# EAGLE design p25rx_display_rev3 (EAGLE 7.6.0)

## Sheet 1 of 7
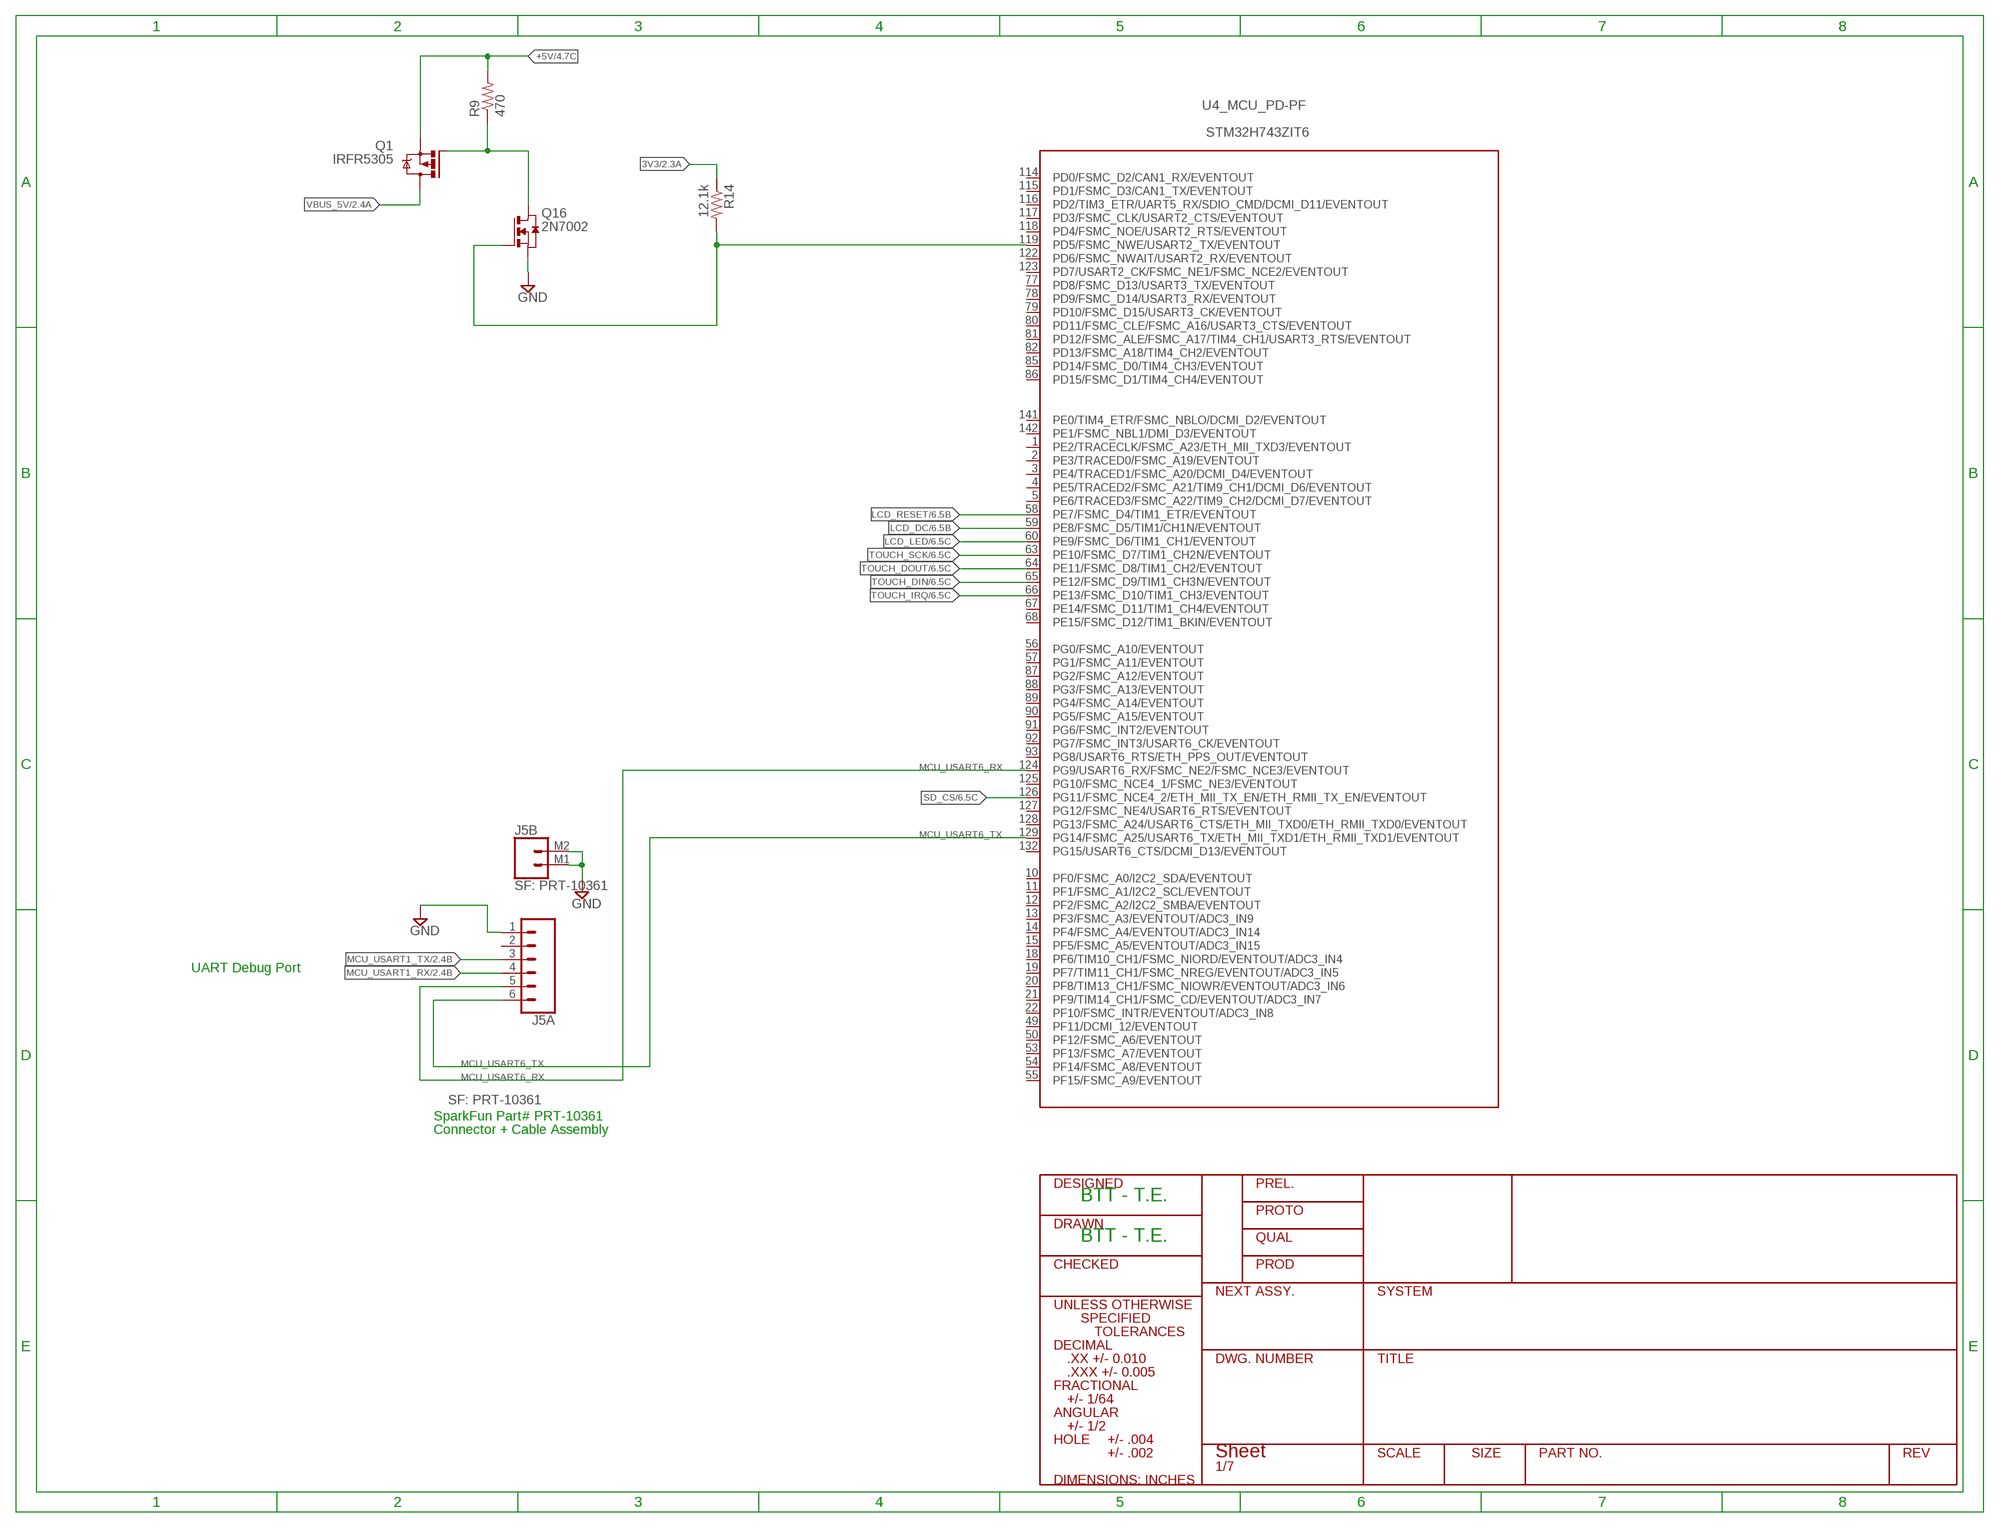
[diagram p0: schematic, sheet 1]

### Parts
J5  SF: PRT-10361  JST_6_PIN_HORIZONTAL  [JST-6-SMD-HORI-1.0MM]
Q1  IRFR5305  [D-PAK_TO252AA]
Q16  2N7002  [SOT23_2N7002_PACKAGE]
R9  470  R-US_R0603  [R0603]
R14  12.1k  R-US_R0402  [R0402]
U4  STM32H743ZIT6  STM32F407_144_MG144  [STM32F407_144]

### Nets
3V3: R14.1 ; also sheet 2,3,4,5,6
+5V: Q1.3(S) R9.2 ; also sheet 4,5
GND: J5.1 J5.M1 J5.M2 Q16.2(S) ; also sheet 2,3,4,5,6
LCD_DC: U4.59(_MCU_PD-PF:PE8/FSMC_D5/TIM1/CH1N/EVENTOUT) ; also sheet 6
LCD_LED: U4.60(_MCU_PD-PF:PE9/FSMC_D6/TIM1_CH1/EVENTOUT) ; also sheet 6
LCD_RESET: U4.58(_MCU_PD-PF:PE7/FSMC_D4/TIM1_ETR/EVENTOUT) ; also sheet 6
MCU_USART1_RX: J5.4 ; also sheet 2
MCU_USART1_TX: J5.3 ; also sheet 2
MCU_USART6_RX: J5.5 U4.124(_MCU_PD-PF:PG9/USART6_RX/FSMC_NE2/FSMC_NCE3/EVENTOUT)
MCU_USART6_TX: J5.6 U4.129(_MCU_PD-PF:PG14/FSMC_A25/USART6_TX/ETH_MII_TXD1/ETH_RMII_TXD1/EVENTOUT)
N$3: Q16.1(G) R14.2 U4.119(_MCU_PD-PF:PD5/FSMC_NWE/USART2_TX/EVENTOUT)
N$137: Q1.1(G) Q16.3(D) R9.1
SD_CS: U4.126(_MCU_PD-PF:PG11/FSMC_NCE4_2/ETH_MII_TX_EN/ETH_RMII_TX_EN/EVENTOUT) ; also sheet 6
TOUCH_DIN: U4.65(_MCU_PD-PF:PE12/FSMC_D9/TIM1_CH3N/EVENTOUT) ; also sheet 6
TOUCH_DOUT: U4.64(_MCU_PD-PF:PE11/FSMC_D8/TIM1_CH2/EVENTOUT) ; also sheet 6
TOUCH_IRQ: U4.66(_MCU_PD-PF:PE13/FSMC_D10/TIM1_CH3/EVENTOUT) ; also sheet 6
TOUCH_SCK: U4.63(_MCU_PD-PF:PE10/FSMC_D7/TIM1_CH2N/EVENTOUT) ; also sheet 6
VBUS_5V: Q1.4(D) ; also sheet 2,5
Unconnected: J5.2 U4.1(_MCU_PD-PF:PE2/TRACECLK/FSMC_A23/ETH_MII_TXD3/EVENTOUT) U4.2(_MCU_PD-PF:PE3/TRACED0/FSMC_A19/EVENTOUT) U4.3(_MCU_PD-PF:PE4/TRACED1/FSMC_A20/DCMI_D4/EVENTOUT) U4.4(_MCU_PD-PF:PE5/TRACED2/FSMC_A21/TIM9_CH1/DCMI_D6/EVENTOUT) U4.5(_MCU_PD-PF:PE6/TRACED3/FSMC_A22/TIM9_CH2/DCMI_D7/EVENTOUT) U4.10(_MCU_PD-PF:PF0/FSMC_A0/I2C2_SDA/EVENTOUT) U4.11(_MCU_PD-PF:PF1/FSMC_A1/I2C2_SCL/EVENTOUT) U4.12(_MCU_PD-PF:PF2/FSMC_A2/I2C2_SMBA/EVENTOUT) U4.13(_MCU_PD-PF:PF3/FSMC_A3/EVENTOUT/ADC3_IN9) U4.14(_MCU_PD-PF:PF4/FSMC_A4/EVENTOUT/ADC3_IN14) U4.15(_MCU_PD-PF:PF5/FSMC_A5/EVENTOUT/ADC3_IN15) U4.18(_MCU_PD-PF:PF6/TIM10_CH1/FSMC_NIORD/EVENTOUT/ADC3_IN4) U4.19(_MCU_PD-PF:PF7/TIM11_CH1/FSMC_NREG/EVENTOUT/ADC3_IN5) U4.20(_MCU_PD-PF:PF8/TIM13_CH1/FSMC_NIOWR/EVENTOUT/ADC3_IN6) U4.21(_MCU_PD-PF:PF9/TIM14_CH1/FSMC_CD/EVENTOUT/ADC3_IN7) U4.22(_MCU_PD-PF:PF10/FSMC_INTR/EVENTOUT/ADC3_IN8) U4.49(_MCU_PD-PF:PF11/DCMI_12/EVENTOUT) U4.50(_MCU_PD-PF:PF12/FSMC_A6/EVENTOUT) U4.53(_MCU_PD-PF:PF13/FSMC_A7/EVENTOUT) U4.54(_MCU_PD-PF:PF14/FSMC_A8/EVENTOUT) U4.55(_MCU_PD-PF:PF15/FSMC_A9/EVENTOUT) U4.56(_MCU_PD-PF:PG0/FSMC_A10/EVENTOUT) U4.57(_MCU_PD-PF:PG1/FSMC_A11/EVENTOUT) U4.67(_MCU_PD-PF:PE14/FSMC_D11/TIM1_CH4/EVENTOUT) U4.68(_MCU_PD-PF:PE15/FSMC_D12/TIM1_BKIN/EVENTOUT) U4.77(_MCU_PD-PF:PD8/FSMC_D13/USART3_TX/EVENTOUT) U4.78(_MCU_PD-PF:PD9/FSMC_D14/USART3_RX/EVENTOUT) U4.79(_MCU_PD-PF:PD10/FSMC_D15/USART3_CK/EVENTOUT) U4.80(_MCU_PD-PF:PD11/FSMC_CLE/FSMC_A16/USART3_CTS/EVENTOUT) U4.81(_MCU_PD-PF:PD12/FSMC_ALE/FSMC_A17/TIM4_CH1/USART3_RTS/EVENTOUT) U4.82(_MCU_PD-PF:PD13/FSMC_A18/TIM4_CH2/EVENTOUT) U4.85(_MCU_PD-PF:PD14/FSMC_D0/TIM4_CH3/EVENTOUT) U4.86(_MCU_PD-PF:PD15/FSMC_D1/TIM4_CH4/EVENTOUT) U4.87(_MCU_PD-PF:PG2/FSMC_A12/EVENTOUT) U4.88(_MCU_PD-PF:PG3/FSMC_A13/EVENTOUT) U4.89(_MCU_PD-PF:PG4/FSMC_A14/EVENTOUT) U4.90(_MCU_PD-PF:PG5/FSMC_A15/EVENTOUT) U4.91(_MCU_PD-PF:PG6/FSMC_INT2/EVENTOUT) U4.92(_MCU_PD-PF:PG7/FSMC_INT3/USART6_CK/EVENTOUT) U4.93(_MCU_PD-PF:PG8/USART6_RTS/ETH_PPS_OUT/EVENTOUT) U4.114(_MCU_PD-PF:PD0/FSMC_D2/CAN1_RX/EVENTOUT) U4.115(_MCU_PD-PF:PD1/FSMC_D3/CAN1_TX/EVENTOUT) U4.116(_MCU_PD-PF:PD2/TIM3_ETR/UART5_RX/SDIO_CMD/DCMI_D11/EVENTOUT) U4.117(_MCU_PD-PF:PD3/FSMC_CLK/USART2_CTS/EVENTOUT) U4.118(_MCU_PD-PF:PD4/FSMC_NOE/USART2_RTS/EVENTOUT) U4.122(_MCU_PD-PF:PD6/FSMC_NWAIT/USART2_RX/EVENTOUT) U4.123(_MCU_PD-PF:PD7/USART2_CK/FSMC_NE1/FSMC_NCE2/EVENTOUT) U4.125(_MCU_PD-PF:PG10/FSMC_NCE4_1/FSMC_NE3/EVENTOUT) U4.127(_MCU_PD-PF:PG12/FSMC_NE4/USART6_RTS/EVENTOUT) U4.128(_MCU_PD-PF:PG13/FSMC_A24/USART6_CTS/ETH_MII_TXD0/ETH_RMII_TXD0/EVENTOUT) U4.132(_MCU_PD-PF:PG15/USART6_CTS/DCMI_D13/EVENTOUT) U4.141(_MCU_PD-PF:PE0/TIM4_ETR/FSMC_NBLO/DCMI_D2/EVENTOUT) U4.142(_MCU_PD-PF:PE1/FSMC_NBL1/DMI_D3/EVENTOUT)

### Notes on the sheet
- UART Debug Port
- SparkFun Part# PRT-10361
- Connector + Cable Assembly
- BTT - T.E.
- BTT - T.E.

## Sheet 2 of 7
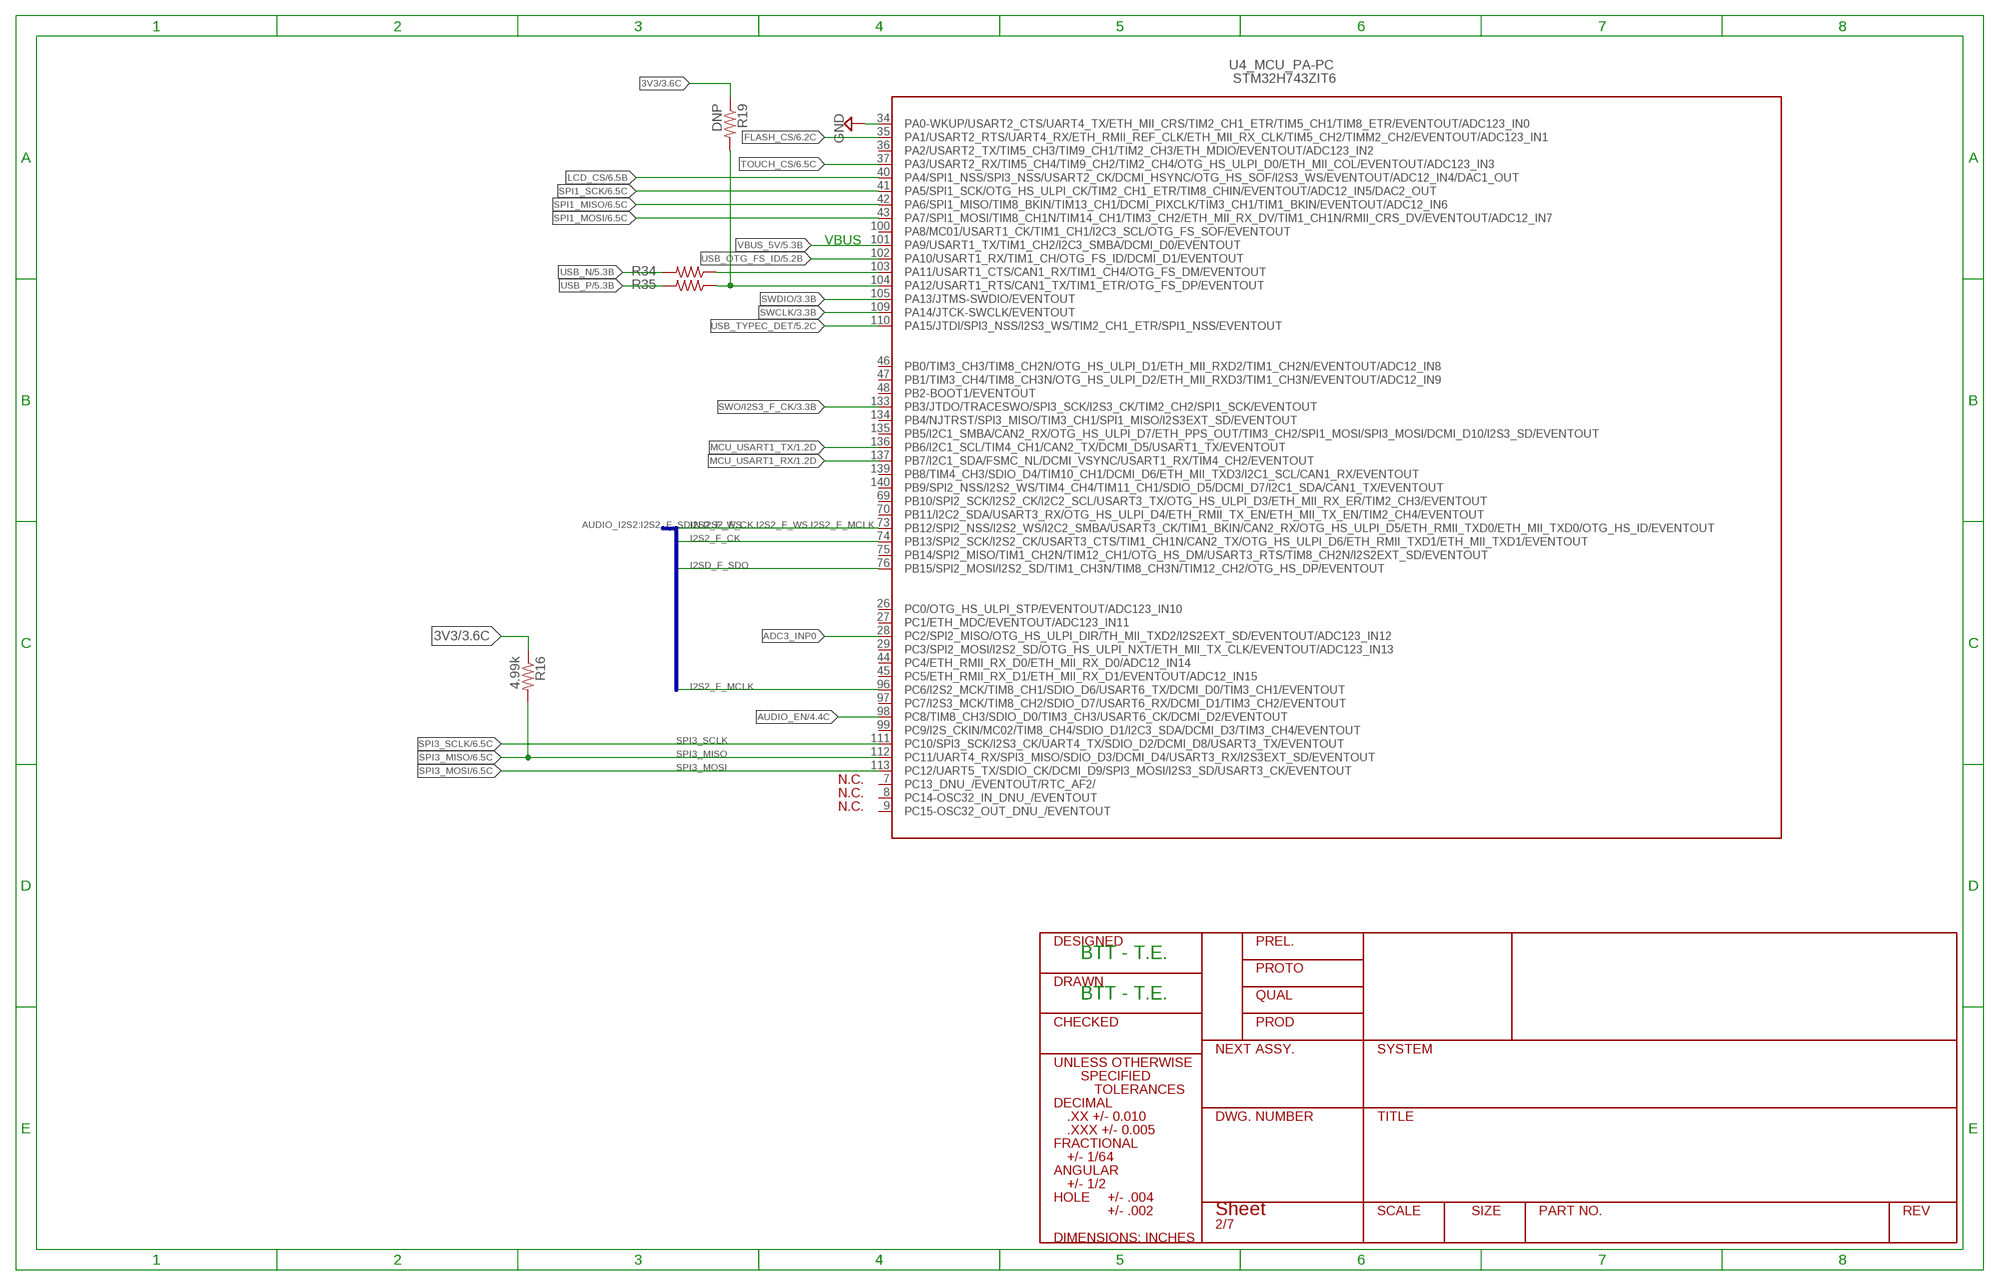
[diagram p1: schematic, sheet 2]

### Parts
R16  4.99k  R-US_R0402  [R0402]
R19  DNP  R-US_R0603  [R0603]
R34  470  R-US_R0402  [R0402]
R35  470  R-US_R0402  [R0402]

### Nets
3V3: R16.1 R19.1 ; also sheet 1,3,4,5,6
ADC3_INP0: U4.28(_MCU_PA-PC:PC2/SPI2_MISO/OTG_HS_ULPI_DIR/TH_MII_TXD2/I2S2EXT_SD/EVENTOUT/ADC123_IN12)
AUDIO_EN: U4.98(_MCU_PA-PC:PC8/TIM8_CH3/SDIO_D0/TIM3_CH3/USART6_CK/DCMI_D2/EVENTOUT) ; also sheet 4
FLASH_CS: U4.35(_MCU_PA-PC:PA1/USART2_RTS/UART4_RX/ETH_RMII_REF_CLK/ETH_MII_RX_CLK/TIM5_CH2/TIMM2_CH2/EVENTOUT/ADC123_IN1) ; also sheet 6
GND: U4.34(_MCU_PA-PC:PA0-WKUP/USART2_CTS/UART4_TX/ETH_MII_CRS/TIM2_CH1_ETR/TIM5_CH1/TIM8_ETR/EVENTOUT/ADC123_IN0) ; also sheet 1,3,4,5,6
I2S2_F_CK: U4.74(_MCU_PA-PC:PB13/SPI2_SCK/I2S2_CK/USART3_CTS/TIM1_CH1N/CAN2_TX/OTG_HS_ULPI_D6/ETH_RMII_TXD1/ETH_MII_TXD1/EVENTOUT) ; also sheet 4
I2S2_F_MCLK: U4.96(_MCU_PA-PC:PC6/I2S2_MCK/TIM8_CH1/SDIO_D6/USART6_TX/DCMI_D0/TIM3_CH1/EVENTOUT) ; also sheet 4
I2S2_F_WS: U4.73(_MCU_PA-PC:PB12/SPI2_NSS/I2S2_WS/I2C2_SMBA/USART3_CK/TIM1_BKIN/CAN2_RX/OTG_HS_ULPI_D5/ETH_RMII_TXD0/ETH_MII_TXD0/OTG_HS_ID/EVENTOUT) ; also sheet 4
I2SD_F_SDO: U4.76(_MCU_PA-PC:PB15/SPI2_MOSI/I2S2_SD/TIM1_CH3N/TIM8_CH3N/TIM12_CH2/OTG_HS_DP/EVENTOUT) ; also sheet 4
LCD_CS: U4.40(_MCU_PA-PC:PA4/SPI1_NSS/SPI3_NSS/USART2_CK/DCMI_HSYNC/OTG_HS_SOF/I2S3_WS/EVENTOUT/ADC12_IN4/DAC1_OUT) ; also sheet 6
MCU_USART1_RX: U4.137(_MCU_PA-PC:PB7/I2C1_SDA/FSMC_NL/DCMI_VSYNC/USART1_RX/TIM4_CH2/EVENTOUT) ; also sheet 1
MCU_USART1_TX: U4.136(_MCU_PA-PC:PB6/I2C1_SCL/TIM4_CH1/CAN2_TX/DCMI_D5/USART1_TX/EVENTOUT) ; also sheet 1
SPI1_MISO: U4.42(_MCU_PA-PC:PA6/SPI1_MISO/TIM8_BKIN/TIM13_CH1/DCMI_PIXCLK/TIM3_CH1/TIM1_BKIN/EVENTOUT/ADC12_IN6) ; also sheet 6
SPI1_MOSI: U4.43(_MCU_PA-PC:PA7/SPI1_MOSI/TIM8_CH1N/TIM14_CH1/TIM3_CH2/ETH_MII_RX_DV/TIM1_CH1N/RMII_CRS_DV/EVENTOUT/ADC12_IN7) ; also sheet 6
SPI1_SCK: U4.41(_MCU_PA-PC:PA5/SPI1_SCK/OTG_HS_ULPI_CK/TIM2_CH1_ETR/TIM8_CHIN/EVENTOUT/ADC12_IN5/DAC2_OUT) ; also sheet 6
SPI3_MISO: R16.2 U4.112(_MCU_PA-PC:PC11/UART4_RX/SPI3_MISO/SDIO_D3/DCMI_D4/USART3_RX/I2S3EXT_SD/EVENTOUT) ; also sheet 6
SPI3_MOSI: U4.113(_MCU_PA-PC:PC12/UART5_TX/SDIO_CK/DCMI_D9/SPI3_MOSI/I2S3_SD/USART3_CK/EVENTOUT) ; also sheet 6
SPI3_SCLK: U4.111(_MCU_PA-PC:PC10/SPI3_SCK/I2S3_CK/UART4_TX/SDIO_D2/DCMI_D8/USART3_TX/EVENTOUT) ; also sheet 6
SWCLK: U4.109(_MCU_PA-PC:PA14/JTCK-SWCLK/EVENTOUT) ; also sheet 3
SWDIO: U4.105(_MCU_PA-PC:PA13/JTMS-SWDIO/EVENTOUT) ; also sheet 3
SWO/I2S3_F_CK: U4.133(_MCU_PA-PC:PB3/JTDO/TRACESWO/SPI3_SCK/I2S3_CK/TIM2_CH2/SPI1_SCK/EVENTOUT) ; also sheet 3
TOUCH_CS: U4.37(_MCU_PA-PC:PA3/USART2_RX/TIM5_CH4/TIM9_CH2/TIM2_CH4/OTG_HS_ULPI_D0/ETH_MII_COL/EVENTOUT/ADC123_IN3) ; also sheet 6
USB_MCU_N: R34.1 U4.103(_MCU_PA-PC:PA11/USART1_CTS/CAN1_RX/TIM1_CH4/OTG_FS_DM/EVENTOUT)
USB_MCU_P: R19.2 R35.1 U4.104(_MCU_PA-PC:PA12/USART1_RTS/CAN1_TX/TIM1_ETR/OTG_FS_DP/EVENTOUT)
USB_N [differential]: R34.2 ; also sheet 5
USB_OTG_FS_ID: U4.102(_MCU_PA-PC:PA10/USART1_RX/TIM1_CH/OTG_FS_ID/DCMI_D1/EVENTOUT) ; also sheet 5
USB_P [differential]: R35.2 ; also sheet 5
USB_TYPEC_DET: U4.110(_MCU_PA-PC:PA15/JTDI/SPI3_NSS/I2S3_WS/TIM2_CH1_ETR/SPI1_NSS/EVENTOUT) ; also sheet 5
VBUS_5V: U4.101(_MCU_PA-PC:PA9/USART1_TX/TIM1_CH2/I2C3_SMBA/DCMI_D0/EVENTOUT) ; also sheet 1,5
Unconnected: U4.7(_MCU_PA-PC:PC13_DNU_/EVENTOUT/RTC_AF2/) U4.8(_MCU_PA-PC:PC14-OSC32_IN_DNU_/EVENTOUT) U4.9(_MCU_PA-PC:PC15-OSC32_OUT_DNU_/EVENTOUT) U4.26(_MCU_PA-PC:PC0/OTG_HS_ULPI_STP/EVENTOUT/ADC123_IN10) U4.27(_MCU_PA-PC:PC1/ETH_MDC/EVENTOUT/ADC123_IN11) U4.29(_MCU_PA-PC:PC3/SPI2_MOSI/I2S2_SD/OTG_HS_ULPI_NXT/ETH_MII_TX_CLK/EVENTOUT/ADC123_IN13) U4.36(_MCU_PA-PC:PA2/USART2_TX/TIM5_CH3/TIM9_CH1/TIM2_CH3/ETH_MDIO/EVENTOUT/ADC123_IN2) U4.44(_MCU_PA-PC:PC4/ETH_RMII_RX_D0/ETH_MII_RX_D0/ADC12_IN14) U4.45(_MCU_PA-PC:PC5/ETH_RMII_RX_D1/ETH_MII_RX_D1/EVENTOUT/ADC12_IN15) U4.46(_MCU_PA-PC:PB0/TIM3_CH3/TIM8_CH2N/OTG_HS_ULPI_D1/ETH_MII_RXD2/TIM1_CH2N/EVENTOUT/ADC12_IN8) U4.47(_MCU_PA-PC:PB1/TIM3_CH4/TIM8_CH3N/OTG_HS_ULPI_D2/ETH_MII_RXD3/TIM1_CH3N/EVENTOUT/ADC12_IN9) U4.48(_MCU_PA-PC:PB2-BOOT1/EVENTOUT) U4.69(_MCU_PA-PC:PB10/SPI2_SCK/I2S2_CK/I2C2_SCL/USART3_TX/OTG_HS_ULPI_D3/ETH_MII_RX_ER/TIM2_CH3/EVENTOUT) U4.70(_MCU_PA-PC:PB11/I2C2_SDA/USART3_RX/OTG_HS_ULPI_D4/ETH_RMII_TX_EN/ETH_MII_TX_EN/TIM2_CH4/EVENTOUT) U4.75(_MCU_PA-PC:PB14/SPI2_MISO/TIM1_CH2N/TIM12_CH1/OTG_HS_DM/USART3_RTS/TIM8_CH2N/I2S2EXT_SD/EVENTOUT) U4.97(_MCU_PA-PC:PC7/I2S3_MCK/TIM8_CH2/SDIO_D7/USART6_RX/DCMI_D1/TIM3_CH2/EVENTOUT) U4.99(_MCU_PA-PC:PC9/I2S_CKIN/MC02/TIM8_CH4/SDIO_D1/I2C3_SDA/DCMI_D3/TIM3_CH4/EVENTOUT) U4.100(_MCU_PA-PC:PA8/MC01/USART1_CK/TIM1_CH1/I2C3_SCL/OTG_FS_SOF/EVENTOUT) U4.134(_MCU_PA-PC:PB4/NJTRST/SPI3_MISO/TIM3_CH1/SPI1_MISO/I2S3EXT_SD/EVENTOUT) U4.135(_MCU_PA-PC:PB5/I2C1_SMBA/CAN2_RX/OTG_HS_ULPI_D7/ETH_PPS_OUT/TIM3_CH2/SPI1_MOSI/SPI3_MOSI/DCMI_D10/I2S3_SD/EVENTOUT) U4.139(_MCU_PA-PC:PB8/TIM4_CH3/SDIO_D4/TIM10_CH1/DCMI_D6/ETH_MII_TXD3/I2C1_SCL/CAN1_RX/EVENTOUT) U4.140(_MCU_PA-PC:PB9/SPI2_NSS/I2S2_WS/TIM4_CH4/TIM11_CH1/SDIO_D5/DCMI_D7/I2C1_SDA/CAN1_TX/EVENTOUT)

### Buses
AUDIO_I2S2:I2S2_F_SDIN,I2S2_F_CK,I2S2_F_WS,I2S2_F_MCLK

### Notes on the sheet
- VBUS
- BTT - T.E.
- BTT - T.E.

## Sheet 3 of 7
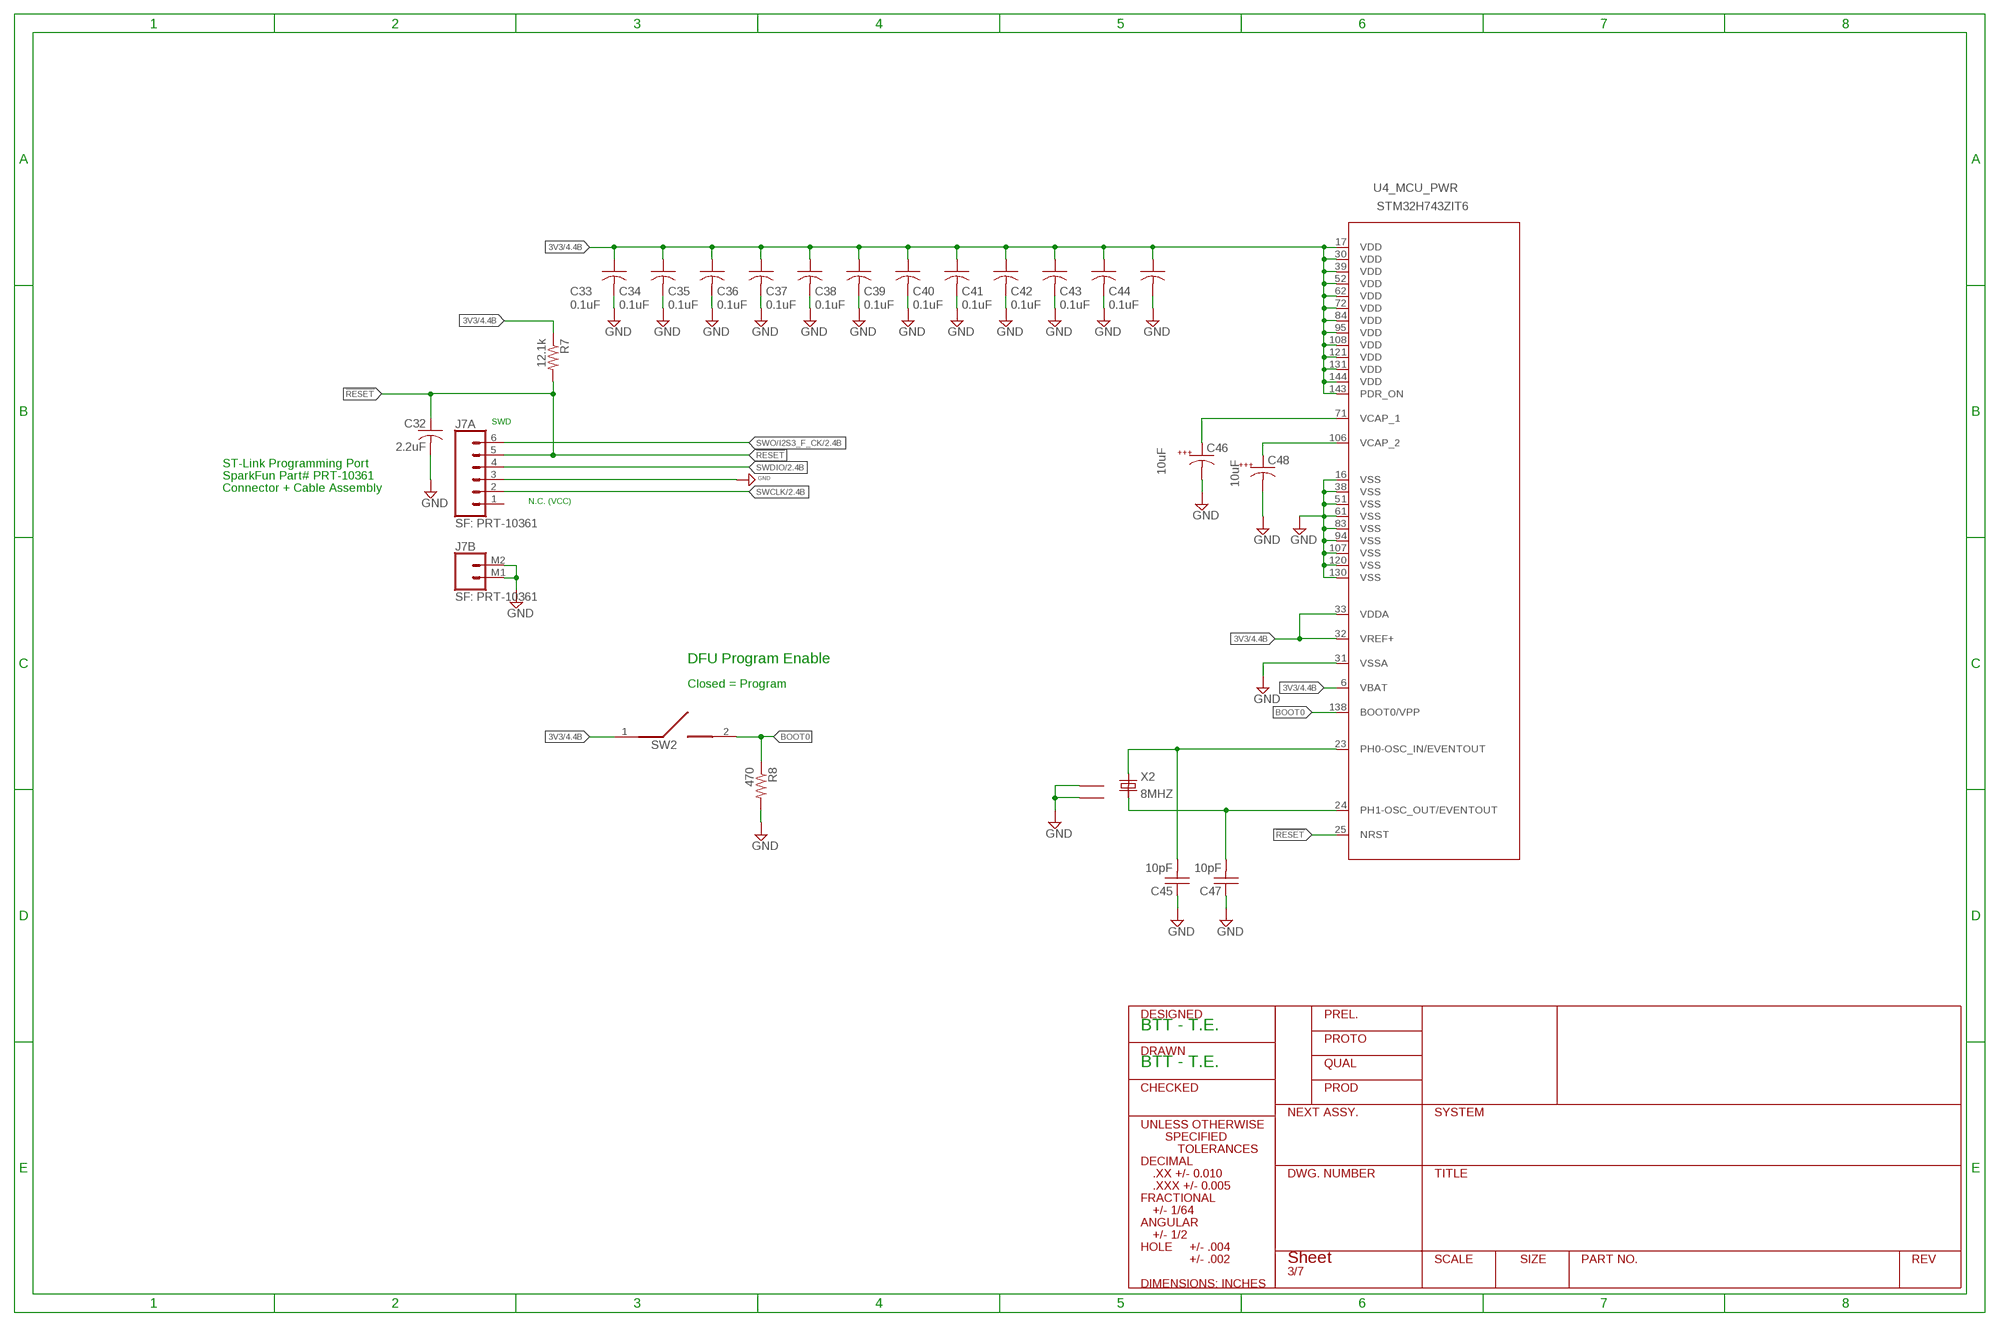
[diagram p2: schematic, sheet 3]

### Parts
C32  2.2uF  C-USC0805  [C0805]
C33  0.1uF  CAPACITOR0402  [0402]
C34  0.1uF  CAPACITOR0402  [0402]
C35  0.1uF  CAPACITOR0402  [0402]
C36  0.1uF  CAPACITOR0402  [0402]
C37  0.1uF  CAPACITOR0402  [0402]
C38  0.1uF  CAPACITOR0402  [0402]
C39  0.1uF  CAPACITOR0402  [0402]
C40  0.1uF  CAPACITOR0402  [0402]
C41  0.1uF  CAPACITOR0402  [0402]
C42  0.1uF  CAPACITOR0402  [0402]
C43  0.1uF  CAPACITOR0402  [0402]
C44  0.1uF  CAPACITOR0402  [0402]
C45  10pF  C-USC0603  [C0603]
C46  10uF  CAPACITOR1210K  [1210K]
C47  10pF  C-USC0603  [C0603]
C48  10uF  CAPACITOR1210K  [1210K]
J7  SF: PRT-10361  JST_6_PIN_HORIZONTAL  [JST-6-SMD-HORI-1.0MM]
R7  12.1k  R-US_R0603  [R0603]
R8  470  R-US_R0402  [R0402]
SW2  CHS-01TA  [CHS1BIT]
X2  8MHZ  ECS-250-20-30B-DUDU  [ECS-250-20-30B-DU_CRYSTAL]

### Nets
3V3: C33.1(A) C34.1(A) C35.1(A) C36.1(A) C37.1(A) C38.1(A) C39.1(A) C40.1(A) C41.1(A) C42.1(A) C43.1(A) C44.1(A) R7.1 SW2.1 U4.6(_MCU_PWR:VBAT) U4.17(_MCU_PWR:VDD) U4.30(_MCU_PWR:VDD) U4.32(_MCU_PWR:VREF+) U4.33(_MCU_PWR:VDDA) U4.39(_MCU_PWR:VDD) U4.52(_MCU_PWR:VDD) U4.62(_MCU_PWR:VDD) U4.72(_MCU_PWR:VDD) U4.84(_MCU_PWR:VDD) U4.95(_MCU_PWR:VDD) U4.108(_MCU_PWR:VDD) U4.121(_MCU_PWR:VDD) U4.131(_MCU_PWR:VDD) U4.143(_MCU_PWR:PDR_ON) U4.144(_MCU_PWR:VDD) ; also sheet 1,2,4,5,6
20MHZ_REF: C45.2 U4.23(_MCU_PWR:PH0-OSC_IN/EVENTOUT) X2.1
!RESET: C32.1 J7.5 R7.2 U4.25(_MCU_PWR:NRST)
BOOT0: R8.1 SW2.2 U4.138(_MCU_PWR:BOOT0/VPP)
GND: C32.2 C33.2(C) C34.2(C) C35.2(C) C36.2(C) C37.2(C) C38.2(C) C39.2(C) C40.2(C) C41.2(C) C42.2(C) C43.2(C) C44.2(C) C45.1 C46.C C47.1 C48.C J7.3 J7.M1 J7.M2 R8.2 U4.16(_MCU_PWR:VSS) U4.31(_MCU_PWR:VSSA) U4.38(_MCU_PWR:VSS) U4.51(_MCU_PWR:VSS) U4.61(_MCU_PWR:VSS) U4.83(_MCU_PWR:VSS) U4.94(_MCU_PWR:VSS) U4.107(_MCU_PWR:VSS) U4.120(_MCU_PWR:VSS) U4.130(_MCU_PWR:VSS) X2.GND@1 X2.GND@2 ; also sheet 1,2,4,5,6
N$30: C48.A U4.106(_MCU_PWR:VCAP_2)
N$35: C46.A U4.71(_MCU_PWR:VCAP_1)
SWCLK: J7.2 ; also sheet 2
SWDIO: J7.4 ; also sheet 2
SWO/I2S3_F_CK: J7.6 ; also sheet 2
X2: C47.2 U4.24(_MCU_PWR:PH1-OSC_OUT/EVENTOUT) X2.3
Unconnected: J7.1

### Notes on the sheet
- SWD
- ST-Link Programming Port
- SparkFun Part# PRT-10361
- Connector + Cable Assembly
- N.C. (VCC)
- DFU Program Enable
- Closed = Program
- BTT - T.E.
- BTT - T.E.

## Sheet 4 of 7
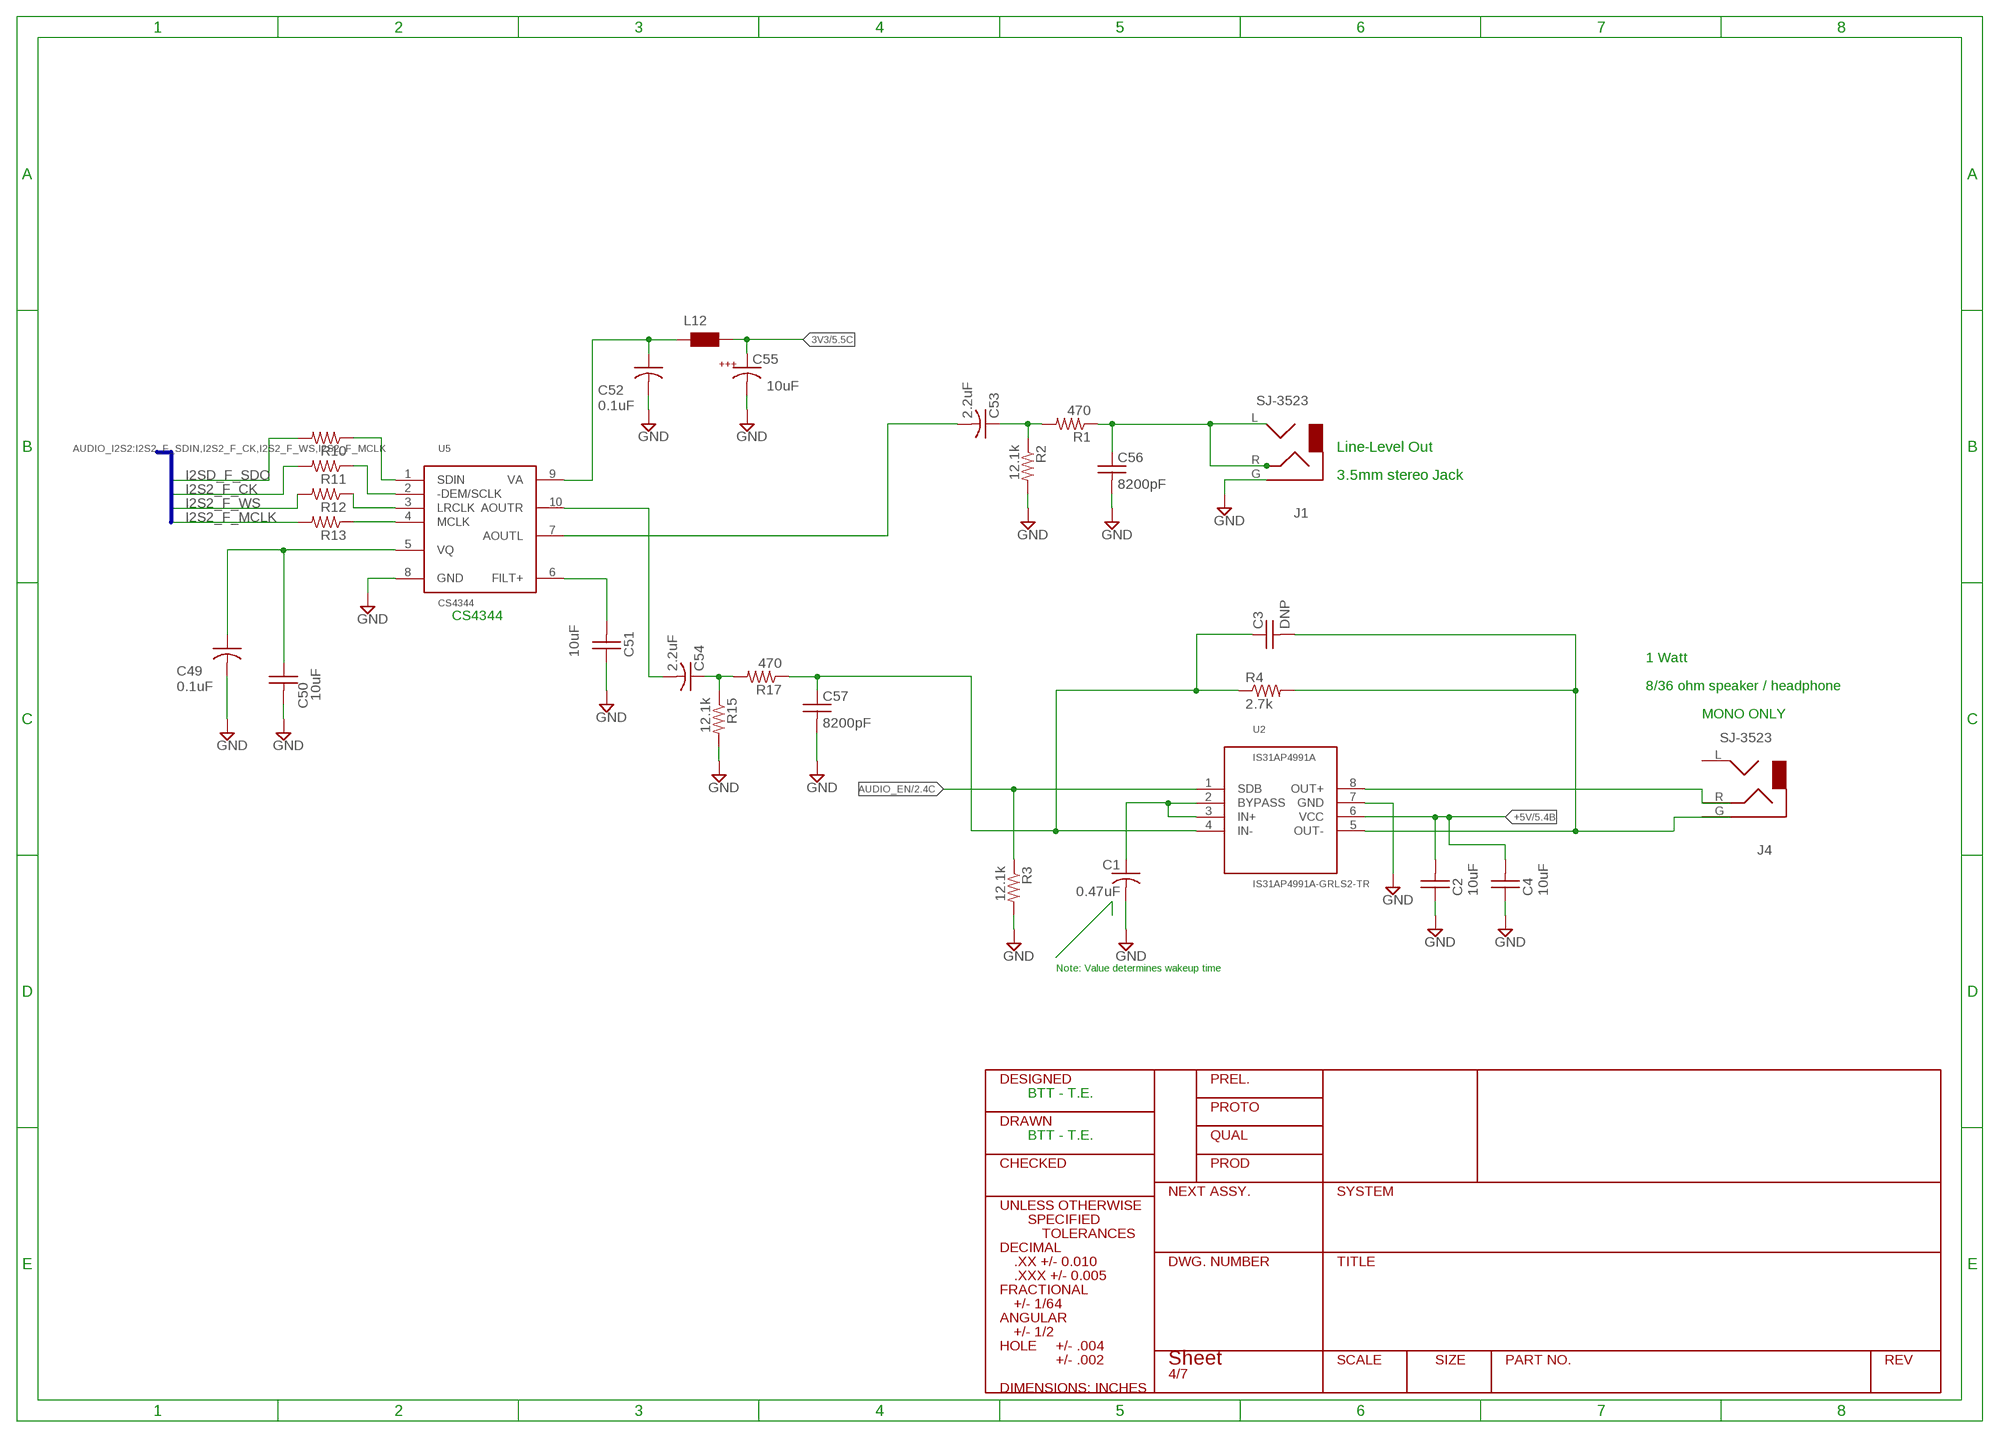
[diagram p3: schematic, sheet 4]

### Parts
C1  0.47uF  C-USC0805  [C0805]
C2  10uF  C-USC0805  [C0805]
C3  DNP  C-USC0603  [C0603]
C4  10uF  C-USC0805  [C0805]
C49  0.1uF  CAPACITOR0402  [0402]
C50  10uF  C-USC0805  [C0805]
C51  10uF  C-USC0805  [C0805]
C52  0.1uF  CAPACITOR0402  [0402]
C53  2.2uF  C-USC0805  [C0805]
C54  2.2uF  C-USC0805  [C0805]
C55  10uF  CAPACITOR1210K  [1210K]
C56  8200pF  C-USC0603  [C0603]
C57  8200pF  C-USC0603  [C0603]
J1  SJ-3523  CUI_SJ-3523SMT  [SJ-3523]
J4  SJ-3523  CUI_SJ-3523SMT  [SJ-3523]
L12  WE-CBF_0603  [0603]
R1  470  R-US_R0402  [R0402]
R2  12.1k  R-US_R0603  [R0603]
R3  12.1k  R-US_R0603  [R0603]
R4  2.7k  R-US_R0603  [R0603]
R10  470  R-US_R0402  [R0402]
R11  470  R-US_R0402  [R0402]
R12  470  R-US_R0402  [R0402]
R13  470  R-US_R0402  [R0402]
R15  12.1k  R-US_R0603  [R0603]
R17  470  R-US_R0402  [R0402]
U2  IS31AP4991A-GRLS2-TR  [SO8]
U5  CS4344  [MSOP10]

### Nets
3V3: C55.A L12.2 ; also sheet 1,2,3,5,6
+5V: C2.2 C4.2 U2.6(VCC) ; also sheet 1,5
AUDIO_EN: R3.1 U2.1(SDB) ; also sheet 2
AUDIO_LEFT: C56.1 J1.L J1.R R1.1
AUDIO_RIGHT: C3.1 C57.1 R4.1 R17.1 U2.4(IN-)
GND: C1.2 C2.1 C4.1 C49.2(C) C50.2 C51.1 C52.2(C) C55.C C56.2 C57.2 J1.G R2.2 R3.2 R15.2 U2.7(GND) U5.8(GND) ; also sheet 1,2,3,5,6
I2S2_F_CK: R11.2 ; also sheet 2
I2S2_F_MCLK: R13.2 ; also sheet 2
I2S2_F_WS: R12.2 ; also sheet 2
I2SD_F_SDO: R10.2 ; also sheet 2
N$2: J4.R U2.8(OUT+)
N$5: C1.1 U2.2(BYPASS) U2.3(IN+)
N$6: C3.2 J4.G R4.2 U2.5(OUT-)
N$16: C53.2 U5.7(AOUTL)
N$26: C54.2 U5.10(AOUTR)
N$27: R13.1 U5.4(MCLK)
N$29: R12.1 U5.3(LRCLK)
N$34: R11.1 U5.2(-DEM/SCLK)
N$43: R10.1 U5.1(SDIN)
N$51: C51.2 U5.6(FILT+)
N$53: C49.1(A) C50.1 U5.5(VQ)
N$56: C53.1 R1.2 R2.1
N$57: C54.1 R15.1 R17.2
N$66: C52.1(A) L12.1 U5.9(VA)
Unconnected: J4.L

### Buses
AUDIO_I2S2:I2S2_F_SDIN,I2S2_F_CK,I2S2_F_WS,I2S2_F_MCLK

### Notes on the sheet
- Line-Level Out
- 3.5mm stereo Jack
- CS4344
- 1 Watt
- 8/36 ohm speaker / headphone
- MONO ONLY
- Note: Value determines wakeup time
- BTT - T.E.
- BTT - T.E.

## Sheet 5 of 7
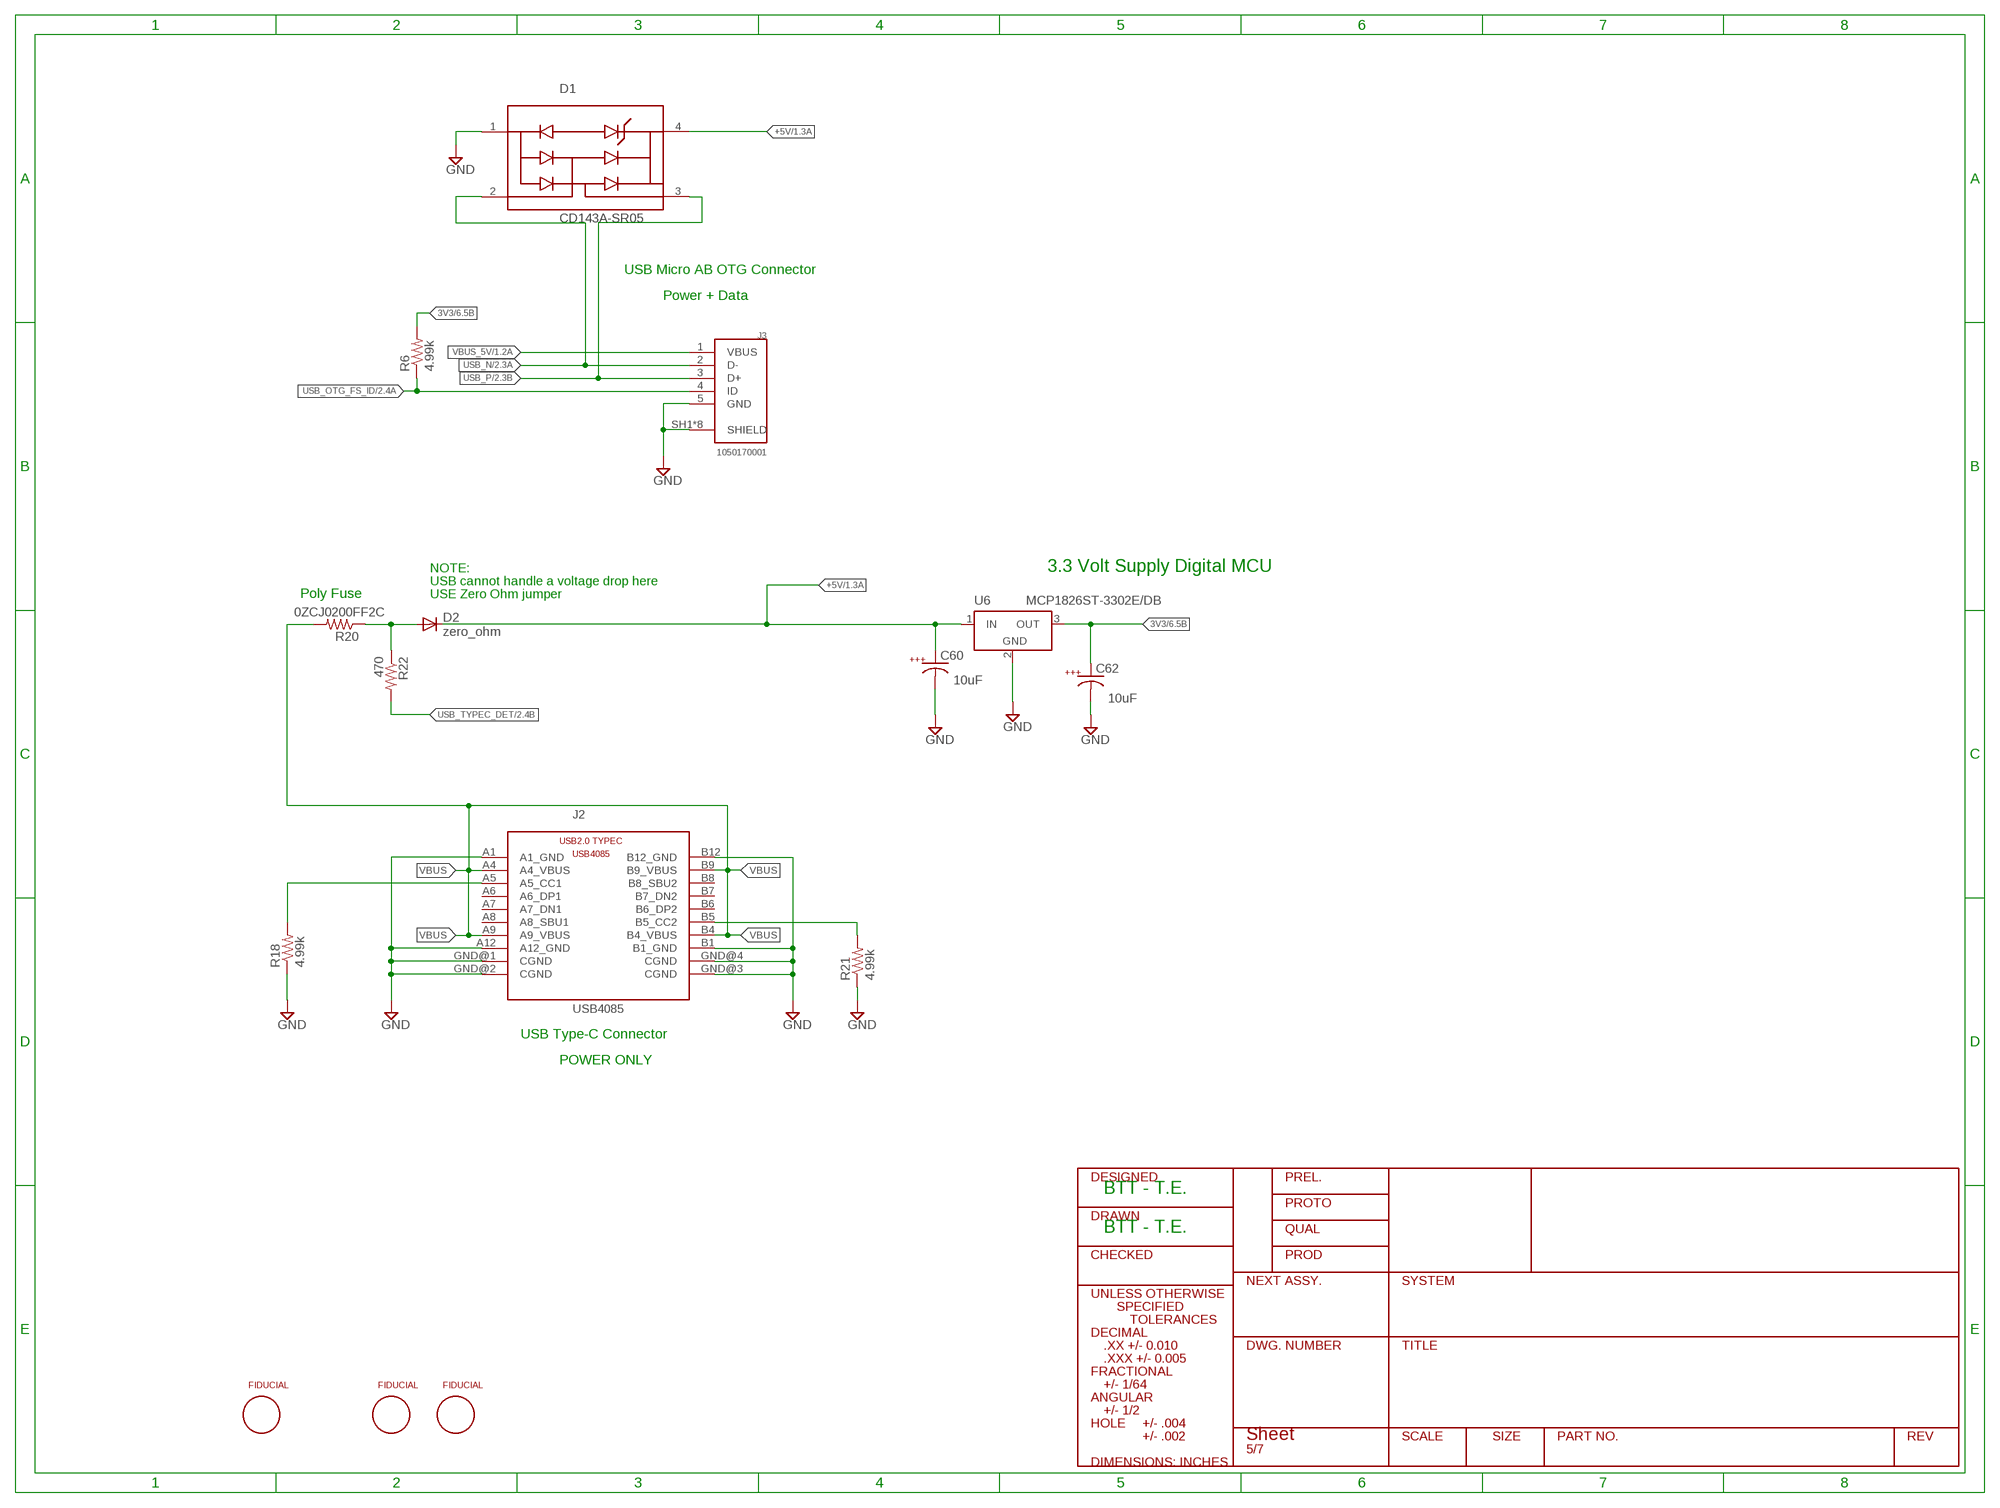
[diagram p4: schematic, sheet 5]

### Parts
C60  10uF  CAPACITOR1210K  [1210K]
C62  10uF  CAPACITOR1210K  [1210K]
D1  CD143A-SR05  SR2.8_TVS  [SR2.8.TCT_1PRIMARY]
D2  zero_ohm  DIODE-SMB  [SMB]
FID1  FIDUCIALSMD  [FIDUCIAL]
FID3  FIDUCIALSMD  [FIDUCIAL]
FID4  FIDUCIALSMD  [FIDUCIAL]
J2  USB4085  [GCT_PN_USB4085]
J3  1050170001  [MOLEX_1050170001]
R6  4.99k  R-US_R0402  [R0402]
R18  4.99k  R-US_R0402  [R0402]
R20  0ZCJ0200FF2C  R-US_R1206  [R1206]
R21  4.99k  R-US_R0402  [R0402]
R22  470  R-US_R0402  [R0402]
U6  MCP1826ST-3302E/DB  LT1129CST5  [SOT223]

### Nets
3V3: C62.A R6.2 U6.3(OUT) ; also sheet 1,2,3,4,6
+5V: C60.A D1.4(REF) D2.C U6.1(IN) ; also sheet 1,4
GND: C60.C C62.C D1.1(GND) J2.A1(A1_GND) J2.A12(A12_GND) J2.B1(B1_GND) J2.B12(B12_GND) J2.GND@1(CGND) J2.GND@2(CGND) J2.GND@3(CGND) J2.GND@4(CGND) J3.5(GND) J3.SH1(SHIELD) J3.SH2(SHIELD) J3.SH3(SHIELD) J3.SH4(SHIELD) J3.SH5(SHIELD) J3.SH6(SHIELD) J3.SH7(SHIELD) J3.SH8(SHIELD) R18.1 R21.1 U6.2(GND) ; also sheet 1,2,3,4,6
N$1: D2.A R20.1 R22.1
N$20: J2.B5(B5_CC2) R21.2
N$122: J2.A5(A5_CC1) R18.2
USB_N [differential]: D1.2(I/O) J3.2(D-) ; also sheet 2
USB_OTG_FS_ID: J3.4(ID) R6.1 ; also sheet 2
USB_P [differential]: D1.3(I/O) J3.3(D+) ; also sheet 2
USB_TYPEC_DET: R22.2 ; also sheet 2
VBUS: J2.A4(A4_VBUS) J2.A9(A9_VBUS) J2.B4(B4_VBUS) J2.B9(B9_VBUS) R20.2
VBUS_5V: J3.1(VBUS) ; also sheet 1,2
Unconnected: J2.A6(A6_DP1) J2.A7(A7_DN1) J2.A8(A8_SBU1) J2.B6(B6_DP2) J2.B7(B7_DN2) J2.B8(B8_SBU2)

### Notes on the sheet
- USB Micro AB OTG Connector
- Power + Data
- NOTE: | 3.3 Volt Supply Digital MCU
- USB cannot handle a voltage drop here
- Poly Fuse | USE Zero Ohm jumper
- USB Type-C Connector
- POWER ONLY
- BTT - T.E.
- BTT - T.E.

## Sheet 6 of 7
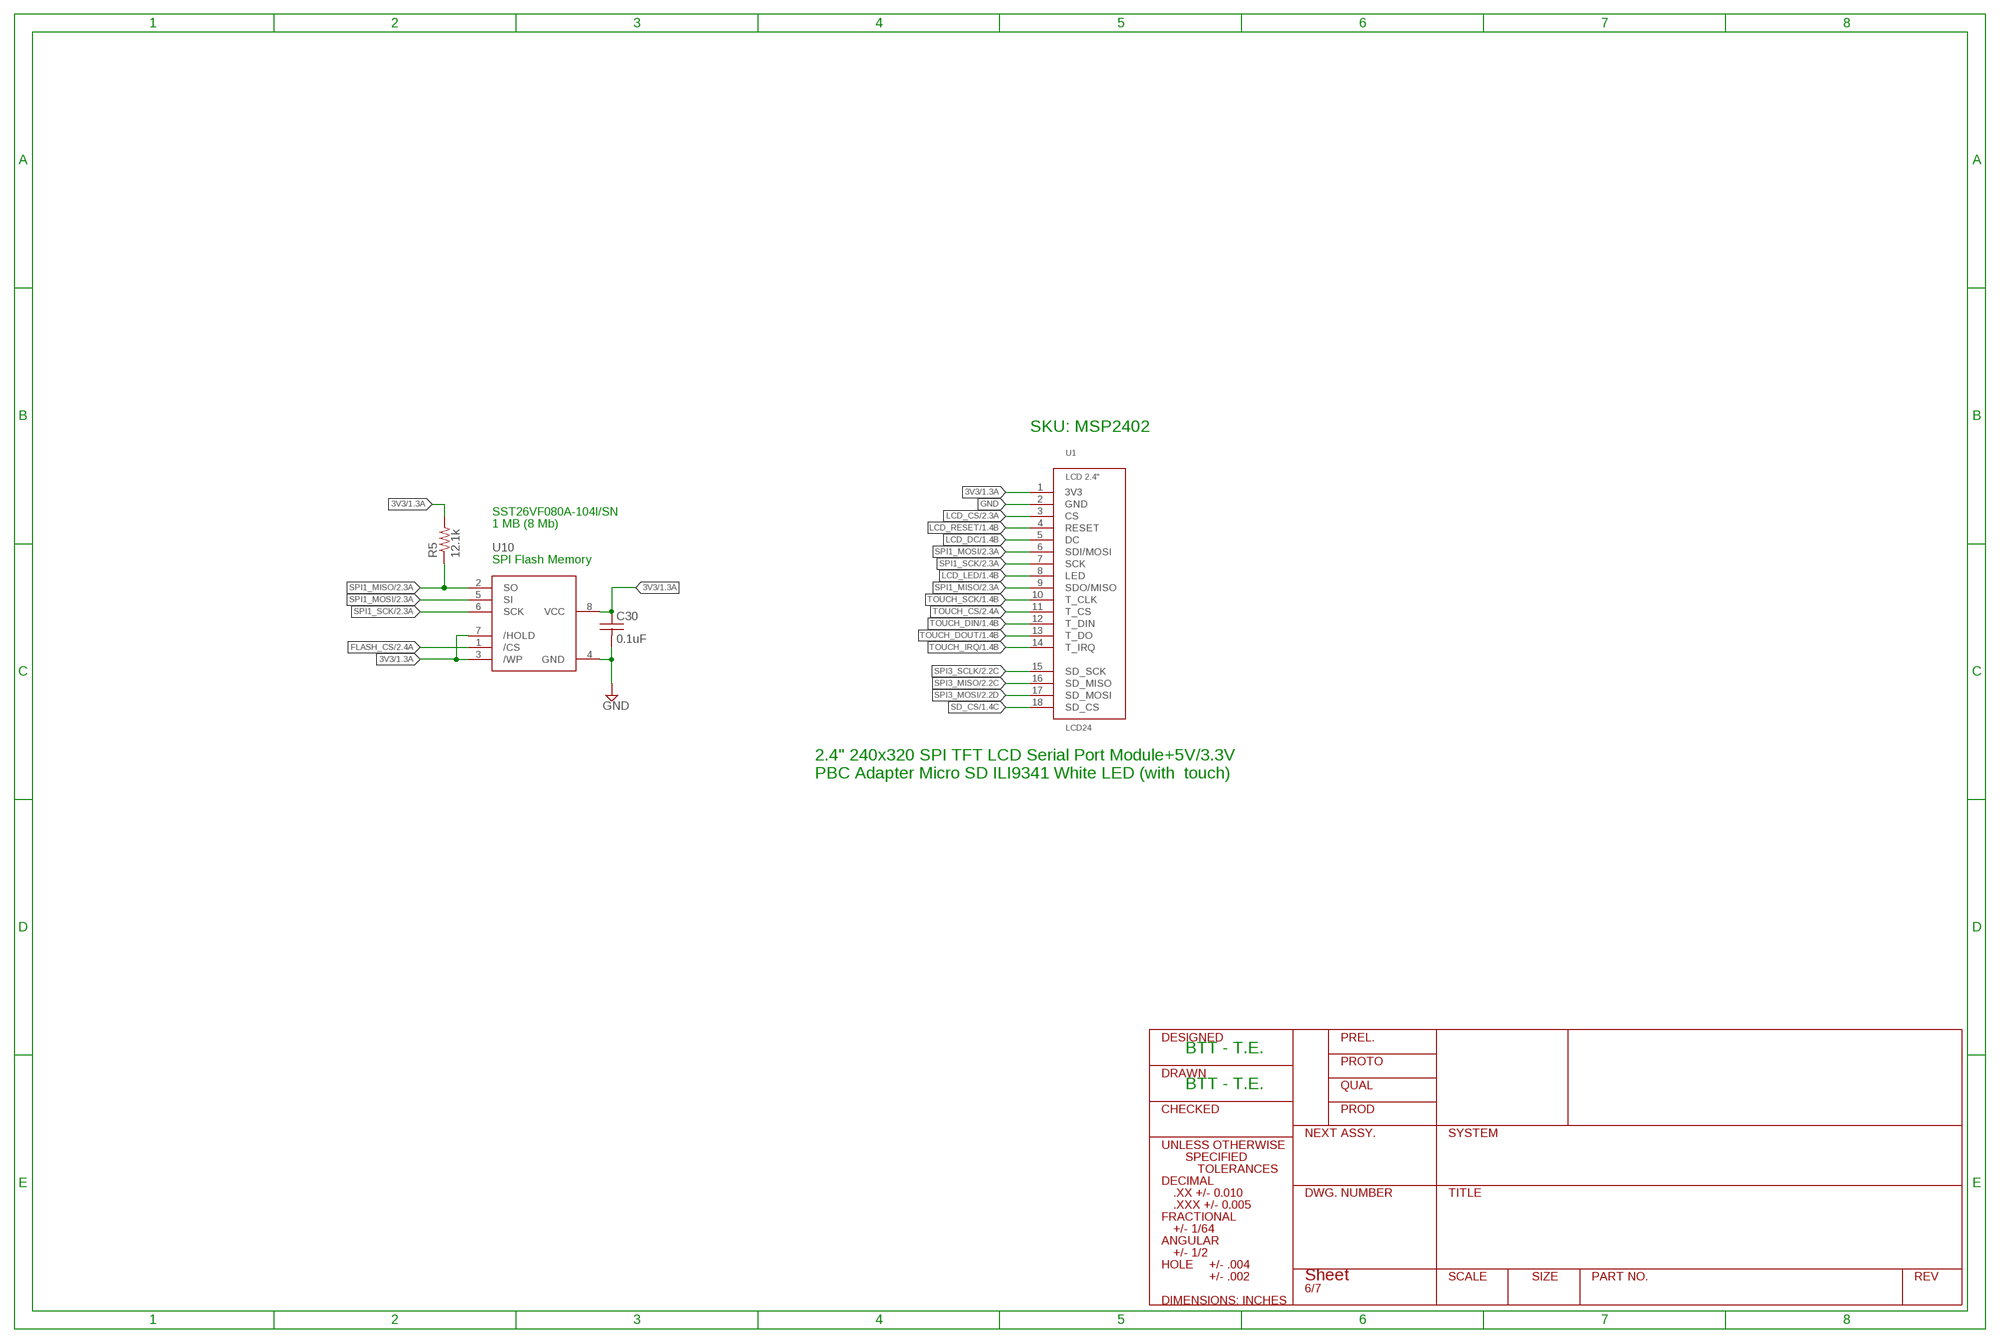
[diagram p5: schematic, sheet 6]

### Parts
C30  0.1uF  C-USC0402  [C0402]
R5  12.1k  R-US_R0603  [R0603]
U1  LCD24  [LCD_24]
U10  AT25F512ASOIC  [SO8]

### Nets
3V3: C30.1 R5.2 U1.1(3V3) U10.3(/WP) U10.7(/HOLD) U10.8(VCC) ; also sheet 1,2,3,4,5
FLASH_CS: U10.1(/CS) ; also sheet 2
GND: C30.2 U1.2(GND) U10.4(GND) ; also sheet 1,2,3,4,5
LCD_CS: U1.3(CS) ; also sheet 2
LCD_DC: U1.5(DC) ; also sheet 1
LCD_LED: U1.8(LED) ; also sheet 1
LCD_RESET: U1.4(RESET) ; also sheet 1
SD_CS: U1.18(SD_CS) ; also sheet 1
SPI1_MISO: R5.1 U1.9(SDO/MISO) U10.2(SO) ; also sheet 2
SPI1_MOSI: U1.6(SDI/MOSI) U10.5(SI) ; also sheet 2
SPI1_SCK: U1.7(SCK) U10.6(SCK) ; also sheet 2
SPI3_MISO: U1.16(SD_MISO) ; also sheet 2
SPI3_MOSI: U1.17(SD_MOSI) ; also sheet 2
SPI3_SCLK: U1.15(SD_SCK) ; also sheet 2
TOUCH_CS: U1.11(T_CS) ; also sheet 2
TOUCH_DIN: U1.12(T_DIN) ; also sheet 1
TOUCH_DOUT: U1.13(T_DO) ; also sheet 1
TOUCH_IRQ: U1.14(T_IRQ) ; also sheet 1
TOUCH_SCK: U1.10(T_CLK) ; also sheet 1

### Notes on the sheet
- SKU: MSP2402
- SST26VF080A-104I/SN
- 1 MB (8 Mb)
- SPI Flash Memory
- 2.4" 240x320 SPI TFT LCD Serial Port Module+5V/3.3V 
  PBC Adapter Micro SD ILI9341 White LED (with  touch)
- BTT - T.E.
- BTT - T.E.

## Sheet 7 of 7
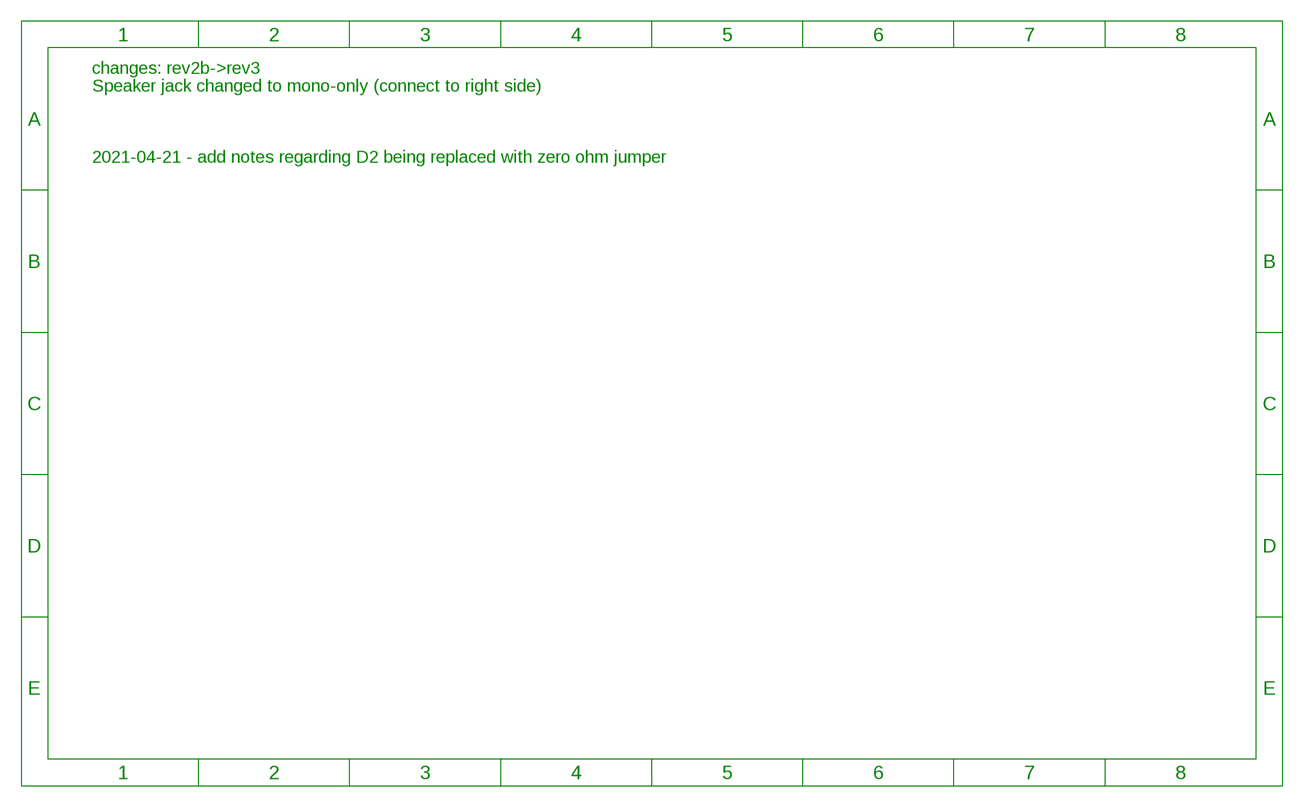
[diagram p6: schematic, sheet 7]

### Notes on the sheet
- changes: rev2b->rev3
- Speaker jack changed to mono-only (connect to right side)
- 2021-04-21 - add notes regarding D2 being replaced with zero ohm jumper

## Power pins joined to a net without a drawn wire
GND: U6.4(GND)

## Library data of the parts
C1 C32 C53 C54 = resistor:C-US: CAPACITOR, American symbol
C2-C4 C50 C51 C56 C57 = misclib3:C-US: CAPACITOR, American symbol
C30 = m64library:C-US: CAPACITOR, American symbol
C33-C44 C49 C52 = misclib4:CAPACITOR
C45 C47 = misc6:C-US: CAPACITOR, American symbol
C46 C48 C55 C60 C62 = misc5:CAPACITOR
D1 = misc8:SR2.8_TVS
D2 = diode:DIODE-: DIODE
FID1 FID3 FID4 = misclib2:FIDUCIAL
J1 J4 = misclib3:CUI_SJ-3523
J2 = GCT_usb4085:USB4085
J3 = usb-dvi-hdmi-connectors:1050170001: Conn.; Data; USB; Recept.; Micro; B Type; Bottom Mount, SMT, with Solder Tabs, Lead-Free; DESCRIPTION: Conn.; Data; USB; Recept.; Micro; B Type; Bottom Mount, SMT, with Solder Tabs, Lead-Free; DIGI-KEY_PART_NUMBER: WM1399CT-ND; DIGI-KEY_PURCHASE_URL: https://www.digikey.se/product-detail/en/molex/1050170001/WM1399CT-ND/2350885?utm_source=snapeda&utm_medium=aggregator&utm_campaign=symbol; MF: Molex; MP: 1050170001; PACKAGE: None
J5 J7 = SparkFun-Connectors:JST_6_PIN_HORIZONTAL: JST 6 pin horizontal connector JST-SH type. Here is the connector we sell at SparkFun: name <link> (XXX-00000) Datasheet <http://www.sparkfun.com/datasheets/GPS/EM406-SMDConnector-eSH.pdf> It was used on these SparkFun products: name <link> (XXX-00000) name <link> (XXX-00000); PROD_ID: XXX-00000; VALUE: BM06B-SRSS-TB
L12 = wuerth-elektronik:WE-CBF: SMD EMI Suppression Ferrite Beads - excellent anti-EMI properties - low DCR - impedances till 3000 ohms - rated current up to 6 A
Q1 = transistor-power:IRF?5305: HEXFET Power MOSFET Source: http://www.irf.com/product-info/datasheets/data/irfr5305pbf.pdf
Q16 = fets:2N7002: MOS FET
R1 R8 R10-R14 R16 R17 R22 R34 R35 = misclib3:R-US_: RESISTOR, American symbol
R2-R7 R9 R15 R18 R19 R21 = misc9:R-US_: RESISTOR, American symbol
R20 = resistor:R-US_: RESISTOR, American symbol
SW2 = chs_switch:CHS-01TA
U1 = lcd24:LCD24
U2 = m64library:IS31AP4991A-GRLS2-TR
U4 = misclib2:STM32F407_144_MG: stm32f407_144 edit this description Auto generated by make-symbol-device-package-bsdl.ulp Rev. 43 Source: stm32f407_144.txt Connect-List generated from STM32F407_144.DEV Variant 144 with split-device-symbol.ulp
U5 = cirrus-3:CS4344
U6 = linear-technology:LT1129CST5: VOLTAGE REGULATOR with shutdown; MPN: LT1129CST-5#PBF; OC_FARNELL: 1663375; OC_NEWARK: 57M2069
U10 = m64library:AT25F512A
X2 = ecs_crystal:ECS-250-20-30B-DU

## Net classes
1 differential: width 0.127 mm, clearance 0.127 mm

## Board
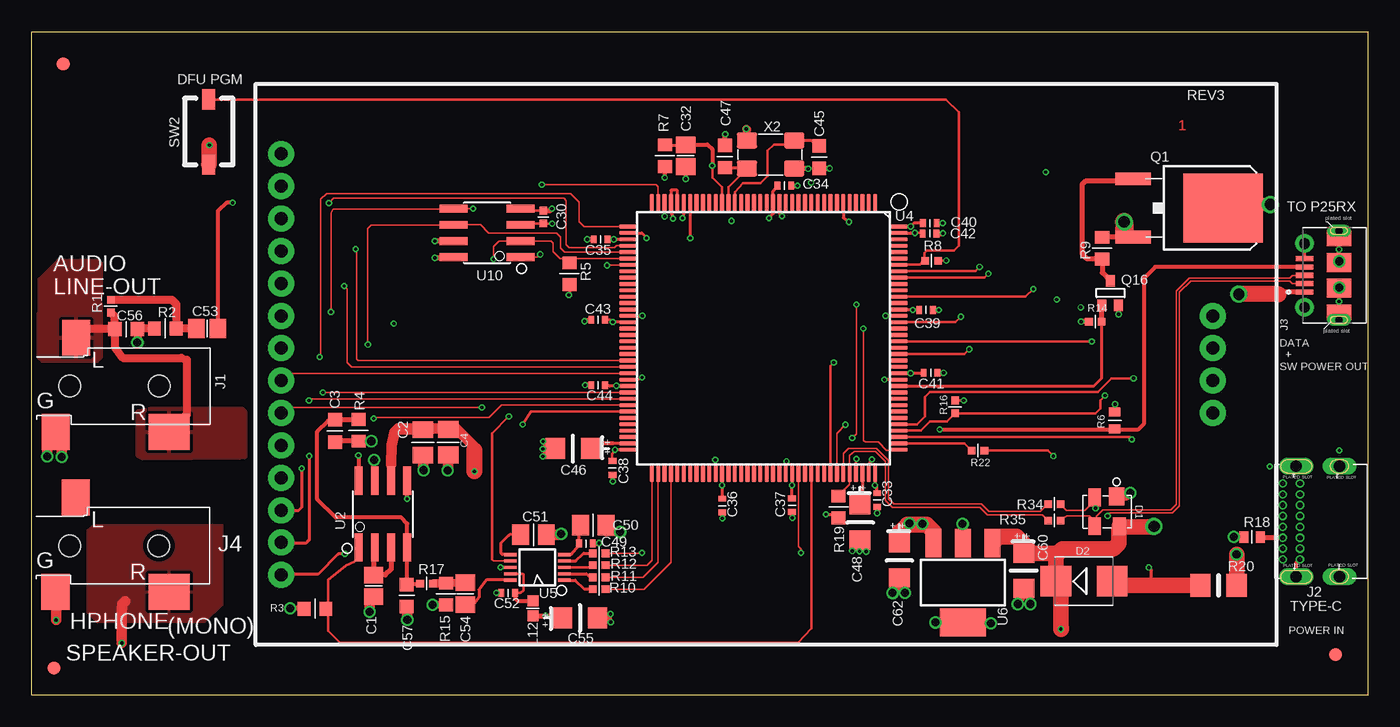
[diagram p7: board, top side]
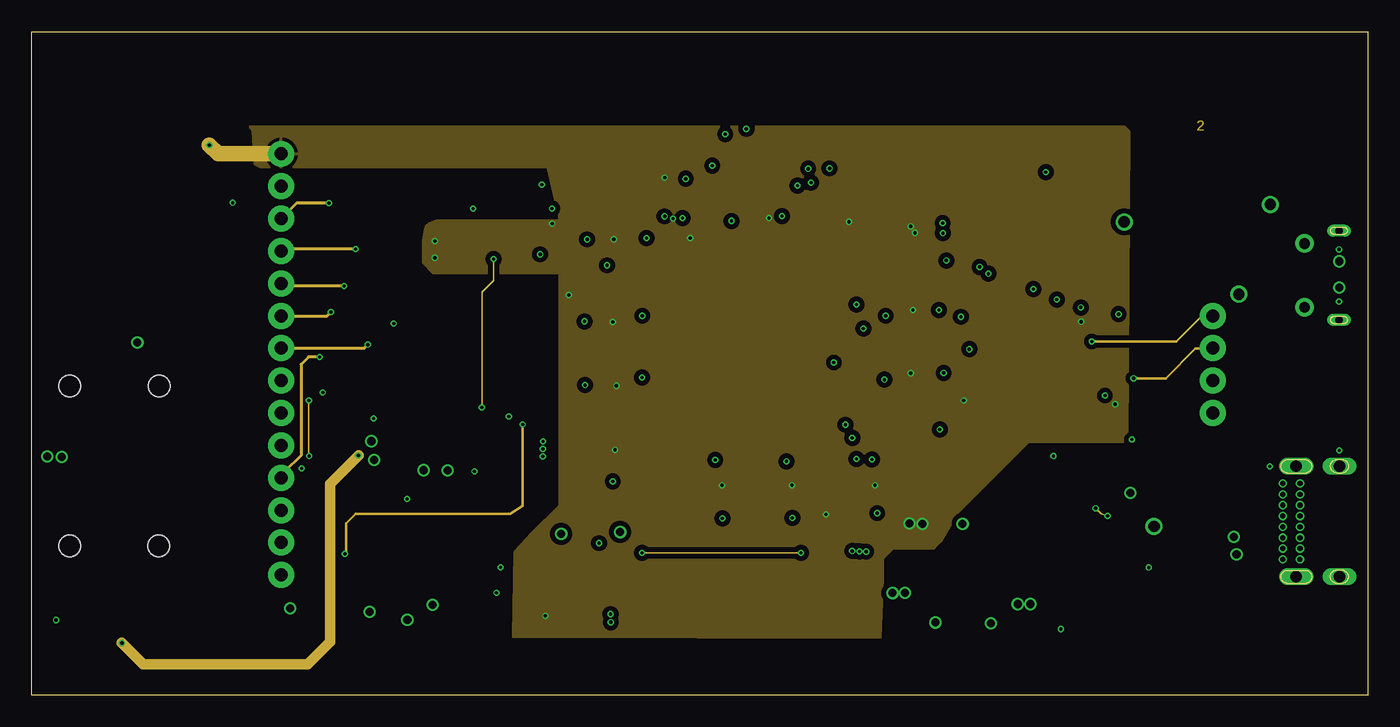
[diagram p8: board, inner layer Route2]
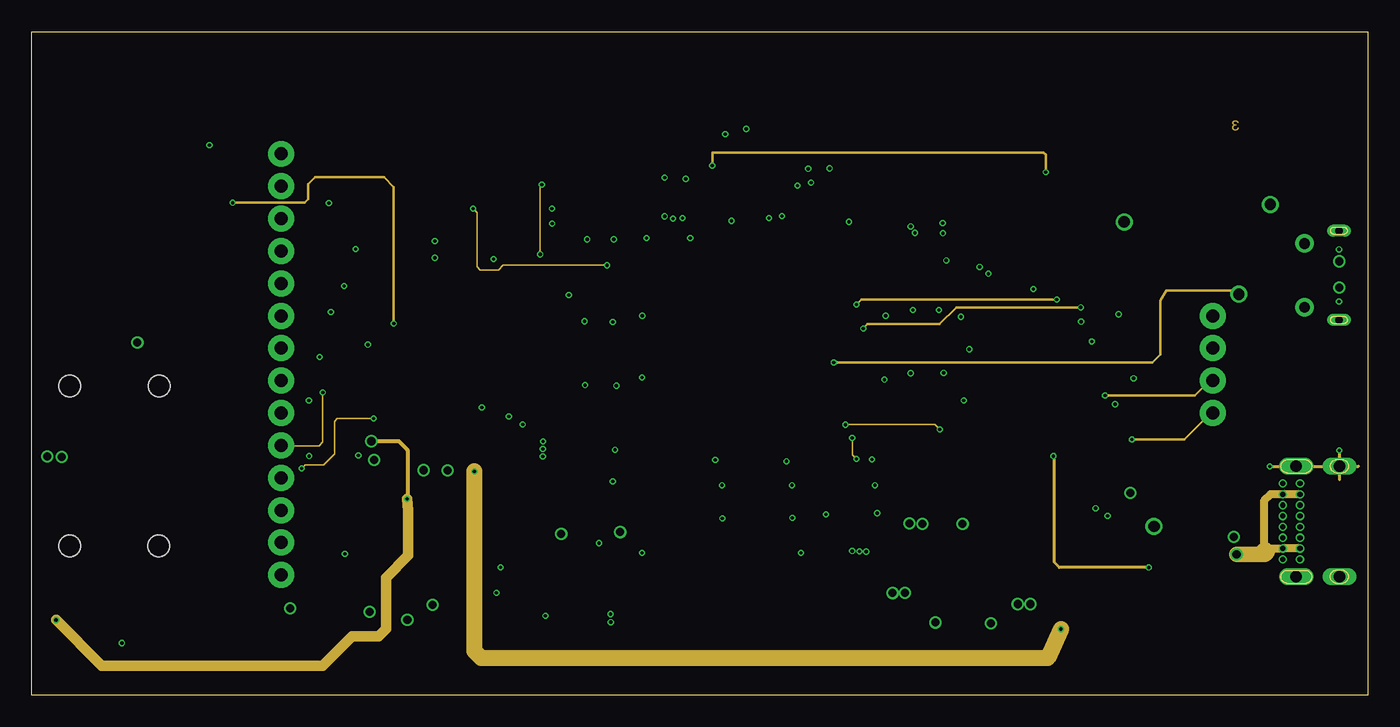
[diagram p9: board, inner layer Route3]
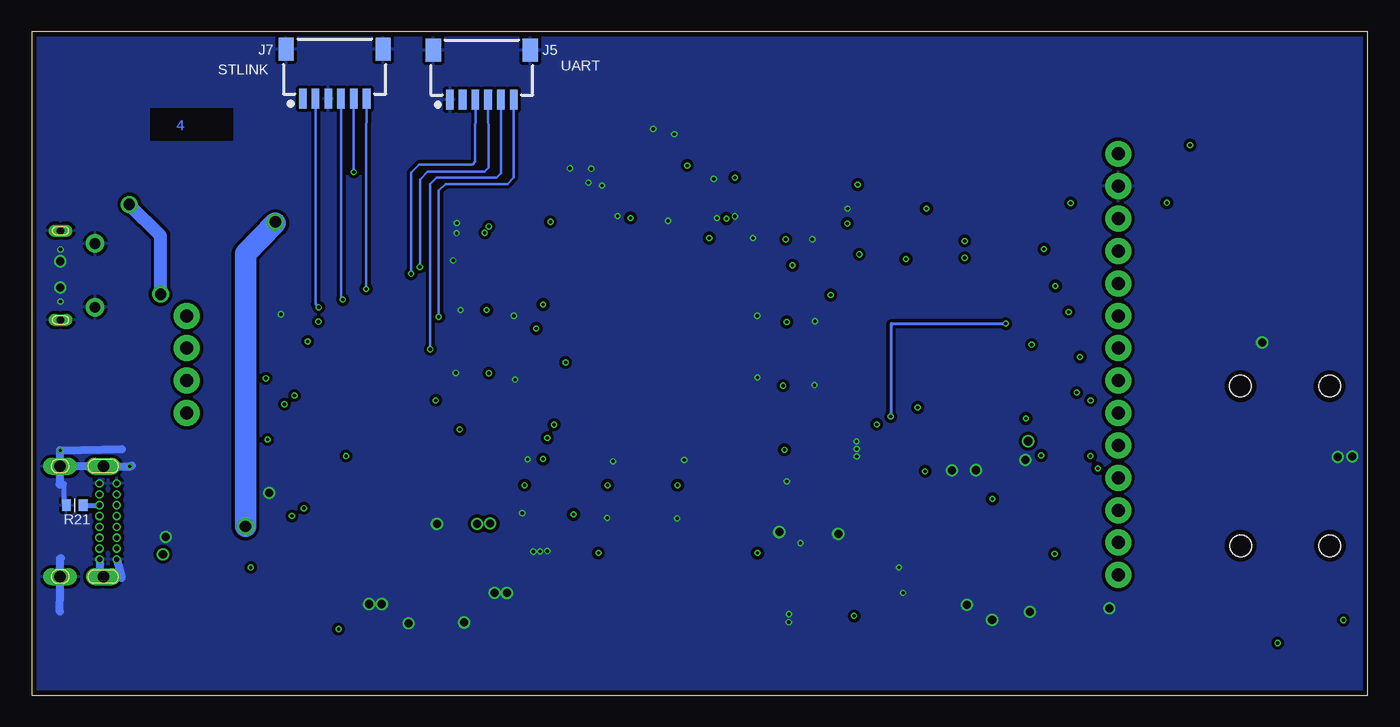
[diagram p10: board, bottom side, seen from below]

Size 104.7 x 52 mm. Coordinates in mm from the lower left corner, seen from the top.
Outline: 0,52 104.7,52 104.7,0 0,0 0,52
Copper layers (1+2+3+16): Top 0.035mm / dielectric 0.2mm / Route2 0.035mm / dielectric 0.15mm / Route3 0.035mm / dielectric 0.2mm / Bottom 0.035mm
Design rules "default *": minimum track width 5mil, minimum drill 10mil, track to track 5mil, track to pad 5mil, pad to pad 5mil, via to via 5mil, smd to smd 0mil, copper to edge 15mil, drill to drill 10mil, minimum pad ring 4.5mil, minimum via ring 4.5mil, stop-mask expansion 0mil, vias tented up to drill 50mil, thermal gap 10mil

### Footprints (pad centres in the part's own frame; a part is rotated, then mirrored left to right if it is on the bottom)
C0805 = smd 1.3 x 1.5: 1 -0.85,0; 2 0.85,0
C0805' = smd 1.3 x 1.6: 1 -1,0; 2 1,0
C0603 = smd 1.05 x 1.08: 1 -0.875,0; 2 0.875,0
C0402 = smd 0.6 x 0.6: 1 -0.5,0; 2 0.501,0
0402 = smd 0.457 x 0.61: 1 -0.524,0; 2 0.549,0
1210K = smd 1.5 x 1.651: A -1.394,0; C 1.352,0
SR2.8.TCT_1PRIMARY = smd 1.397 x 1.194: 1 -1.268,0.813 | smd 1.397 x 0.991: 2 -1.168,-0.914; 3 1.067,-0.914; 4 1.067,1.016
SMB = smd 2.4 x 2.4: A 2.2,0; C -2.2,0
FIDUCIAL = smd 1.016 x 1.016: 1 0,0
SJ-3523 = smd 2.2 x 2.8: G 8.1,3.6; L 6.5,-3.8 | smd 3.2 x 2.8: R -0.8,3.6 | hole 1.7: 0,0; 7,0
GCT_PN_USB4085 = drill 0.4 pad 0.65: A1 -3,2.812; A4 -2.15,2.812; A5 -1.3,2.812; A6 -0.45,2.812; A7 0.4,2.812; A8 1.25,2.812; A9 2.1,2.812; A12 2.95,2.812; B1 2.95,1.458; B4 2.1,1.458; B5 1.25,1.458; B6 0.4,1.458; B7 -0.45,1.458; B8 -1.3,1.458; B9 -2.15,1.458; B12 -2.995,1.46 | drill 0.9 long: GND@1 -4.35,1.75; GND@2 -4.35,-1.63; GND@3 4.3,1.75; GND@4 4.3,-1.63
MOLEX_1050170001 = smd 0.4 x 1.35: 1 -1.3,2.35; 2 -0.65,2.35; 3 0,2.35; 4 0.65,2.35; 5 1.3,2.35 | drill 0.85 pad 1.45: SH1 -2.5,2.35; SH2 2.5,2.35 | drill 0.6 pad 0.95 long: SH3 -3.5,-0.35; SH8 3.5,-0.35 | smd 1.2 x 1.9: SH4 -2.9,-0.35; SH7 2.9,-0.35 | smd 1.5 x 1.9: SH5 -1,-0.35; SH6 1,-0.35
JST-6-SMD-HORI-1.0MM = smd 0.6 x 1.55: 1 -2.5,-4.775; 2 -1.5,-4.775; 3 -0.5,-4.775; 4 0.5,-4.775; 5 1.5,-4.775; 6 2.5,-4.775 | smd 1.2 x 1.8: M1 -3.8,-0.9; M2 3.8,-0.9
0603 = smd 0.864 x 0.864: 1 -0.595,0; 2 0.573,0
D-PAK_TO252AA = smd 1 x 2.794: 1 -2.28,-4.546; 3 2.28,-4.546 | smd 5.4 x 6.2: 4 0,2.5
SOT23_2N7002_PACKAGE = smd 0.7 x 0.9: 1 -0.642,-0.916; 2 0.641,-0.916; 3 0,0.992
R0402 = smd 0.6 x 0.6: 1 -0.5,0; 2 0.5,0
R0603 = smd 1 x 1.1: 1 -0.85,0; 2 0.85,0
R0402' = smd 0.7 x 0.9: 1 -0.65,0; 2 0.65,0
R1206 = smd 1.6 x 1.803: 1 -1.422,0; 2 1.422,0
CHS1BIT = smd 1 x 1.6: 1 0,-2.7; 2 0,2.4
LCD_24 = drill 1.016 pad 2.032: 1 -38.1,16.51; 2 -38.1,13.97; 3 -38.1,11.43; 4 -38.1,8.89; 5 -38.1,6.35; 6 -38.1,3.81; 7 -38.1,1.27; 8 -38.1,-1.27; 9 -38.1,-3.81; 10 -38.1,-6.35; 11 -38.1,-8.89; 12 -38.1,-11.43; 13 -38.1,-13.97; 14 -38.1,-16.51; 15 34.9,-3.81; 16 34.9,-1.27; 17 34.9,1.27; 18 34.9,3.81
SO8 = smd 0.61 x 2.21: 1 -1.905,-2.616; 2 -0.635,-2.616; 3 0.635,-2.616; 4 1.905,-2.616; 5 1.905,2.616; 6 0.635,2.616; 7 -0.635,2.616; 8 -1.905,2.616
STM32F407_144 = smd 1.35 x 0.32: 1 -10.625,8.75; 2 -10.625,8.25; 3 -10.625,7.75; 4 -10.625,7.25; 5 -10.625,6.75; 6 -10.625,6.25; 7 -10.625,5.75; 8 -10.625,5.25; 9 -10.625,4.75; 10 -10.625,4.25; 11 -10.625,3.75; 12 -10.625,3.25; 13 -10.625,2.75; 14 -10.625,2.25; 15 -10.625,1.75; 16 -10.625,1.25; 17 -10.625,0.75; 18 -10.625,0.25; 19 -10.625,-0.25; 20 -10.625,-0.75; 21 -10.625,-1.25; 22 -10.625,-1.75; 23 -10.625,-2.25; 24 -10.625,-2.75; 25 -10.625,-3.25; 26 -10.625,-3.75; 27 -10.625,-4.25; 28 -10.625,-4.75; 29 -10.625,-5.25; 30 -10.625,-5.75; 31 -10.625,-6.25; 32 -10.625,-6.75; 33 -10.625,-7.25; 34 -10.625,-7.75; 35 -10.625,-8.25; 36 -10.625,-8.75; 73 10.625,-8.75; 74 10.625,-8.25; 75 10.625,-7.75; 76 10.625,-7.25; 77 10.625,-6.75; 78 10.625,-6.25; 79 10.625,-5.75; 80 10.625,-5.25; 81 10.625,-4.75; 82 10.625,-4.25; 83 10.625,-3.75; 84 10.625,-3.25; 85 10.625,-2.75; 86 10.625,-2.25; 87 10.625,-1.75; 88 10.625,-1.25; 89 10.625,-0.75; 90 10.625,-0.25; 91 10.625,0.25; 92 10.625,0.75; 93 10.625,1.25; 94 10.625,1.75; 95 10.625,2.25; 96 10.625,2.75; 97 10.625,3.25; 98 10.625,3.75; 99 10.625,4.25; 100 10.625,4.75; 101 10.625,5.25; 102 10.625,5.75; 103 10.625,6.25; 104 10.625,6.75; 105 10.625,7.25; 106 10.625,7.75; 107 10.625,8.25; 108 10.625,8.75 | smd 0.32 x 1.35: 37 -8.75,-10.625; 38 -8.25,-10.625; 39 -7.75,-10.625; 40 -7.25,-10.625; 41 -6.75,-10.625; 42 -6.25,-10.625; 43 -5.75,-10.625; 44 -5.25,-10.625; 45 -4.75,-10.625; 46 -4.25,-10.625; 47 -3.75,-10.625; 48 -3.25,-10.625; 49 -2.75,-10.625; 50 -2.25,-10.625; 51 -1.75,-10.625; 52 -1.25,-10.625; 53 -0.75,-10.625; 54 -0.25,-10.625; 55 0.25,-10.625; 56 0.75,-10.625; 57 1.25,-10.625; 58 1.75,-10.625; 59 2.25,-10.625; 60 2.75,-10.625; 61 3.25,-10.625; 62 3.75,-10.625; 63 4.25,-10.625; 64 4.75,-10.625; 65 5.25,-10.625; 66 5.75,-10.625; 67 6.25,-10.625; 68 6.75,-10.625; 69 7.25,-10.625; 70 7.75,-10.625; 71 8.25,-10.625; 72 8.75,-10.625; 109 8.75,10.625; 110 8.25,10.625; 111 7.75,10.625; 112 7.25,10.625; 113 6.75,10.625; 114 6.25,10.625; 115 5.75,10.625; 116 5.25,10.625; 117 4.75,10.625; 118 4.25,10.625; 119 3.75,10.625; 120 3.25,10.625; 121 2.75,10.625; 122 2.25,10.625; 123 1.75,10.625; 124 1.25,10.625; 125 0.75,10.625; 126 0.25,10.625; 127 -0.25,10.625; 128 -0.75,10.625; 129 -1.25,10.625; 130 -1.75,10.625; 131 -2.25,10.625; 132 -2.75,10.625; 133 -3.25,10.625; 134 -3.75,10.625; 135 -4.25,10.625; 136 -4.75,10.625; 137 -5.25,10.625; 138 -5.75,10.625; 139 -6.25,10.625; 140 -6.75,10.625; 141 -7.25,10.625; 142 -7.75,10.625; 143 -8.25,10.625; 144 -8.75,10.625
MSOP10 = smd 0.25 x 1: 1 -1,-2.113; 2 -0.5,-2.113; 3 0,-2.113; 4 0.5,-2.113; 5 1,-2.113; 6 1,2.113; 7 0.5,2.113; 8 0,2.113; 9 -0.5,2.113; 10 -1,2.113
SOT223 = smd 1.219 x 2.235: 1 -2.311,-3.099; 2 0,-3.099; 3 2.311,-3.099 | smd 3.6 x 2.2: 4 0,3.099
ECS-250-20-30B-DU_CRYSTAL = smd 1.6 x 1.25: 1 -1.9,-1.1; 3 1.8,1.1; GND@1 -1.9,1.1; GND@2 1.8,-1.1

### Placement (x,y rotation side)
C1  26.79,8.56 270 top
C2  10uF  [C0805']  30.65,19.82 90 top
C3  23.77,20.7 270 top
C4  10uF  [C0805']  32.63,19.83 90 top
C30  40.1,37.48 90 top
C32  51.25,42.28 270 top
C33  66.26,15.31 270 top
C34  58.97,39.95 0 top
C35  44.59,35.73 180 top
C36  54.12,14.88 270 top
C37  59.58,14.9 270 top
C38  45.51,17.82 270 top
C39  70.07,30.19 0 top
C40  70.38,37 0 top
C41  70.43,25.27 0 top
C42  70.35,36.19 0 top
C43  44.39,29.43 180 top
C44  44.39,24.3 180 top
C45  61.71,42.18 90 top
C46  42.38,19.32 180 top
C47  54.32,42.23 270 top
C48  64.91,13.5 270 top
C49  43.42,11.89 0 top
C50  10uF  [C0805']  44.01,13.31 0 top
C51  10uF  [C0805']  39.31,12.58 180 top
C52  37.35,8.01 180 top
C53  13.73,28.74 0 top
C54  33.97,7.95 270 top
C55  42.99,6.05 0 top
C56  7.38,28.69 0 top
C57  29.38,7.8 270 top
C60  77.75,9.73 270 top
C62  68,10.54 270 top
D1  84.22,14.32 270 top
D2  82.47,8.93 0 top
FID1  102.18,3.17 90 top
FID3  1.72,2.1 0 top
FID4  2.46,49.5 90 top
J1  9.97,24.22 180 top
J2  100.86,13.64 90 top
J3  102.1,32.91 90 top
J4  9.95,11.7 180 top
J5  69.44,51.45 0 bottom
J7  80.97,51.53 0 bottom
L12  39.28,6.79 270 top
Q1  90.87,38.19 270 top
Q16  84.52,31.49 0 top
R1  6.19,30.5 90 top
R2  10.46,28.74 180 top
R3  22.19,6.77 180 top
R4  25.6,20.75 270 top
R5  42.13,33.04 270 top
R6  4.99k  [R0402']  84.88,21.53 90 top
R7  49.62,42.28 90 top
R8  70.53,34.05 0 top
R9  83.89,35.04 90 top
R10  44.46,8.31 0 top
R11  44.46,9.22 0 top
R12  44.46,10.19 0 top
R13  44.46,11.1 0 top
R14  83.35,29.28 0 top
R15  32.45,7.93 270 top
R16  72.36,22.6 270 top
R17  30.93,8.74 0 top
R18  4.99k  [R0402']  95.63,12.39 0 top
R19  63.24,14.75 90 top
R20  93.01,8.59 0 top
R21  4.99k  [R0402']  101.34,14.88 0 bottom
R22  74.16,19.17 180 top
R34  80.14,14.98 0 top
R35  80.14,13.69 0 top
SW2  13.86,44.29 0 top
U1  57.65,25.93 0 top
U2  27.52,14.19 0 top
U4  57.35,27.98 270 top
U5  39.61,10.01 90 top
U6  72.98,8.81 180 top
U10  35.68,36.24 90 top
X2  57.85,42.38 180 top

### Tracks (layer width: path | path; a pad name or v marks a point on that pad's centre or on a via)
3V3  (via drill 0.25, 0.25 pad 0.25, 0.64)
  Top 0.127: 45.48,29.23 45.51,29.23 v45.53,29.25
  Top 0.203: 45.81,35.73 45.66,35.73 45.64,35.7 45.15,35.7 C35.1 | v45.71,19.23 45.71,19.17 45.46,18.91 45.46,18.4 C38.1 | U10.3 38.4,36.98 C30.1 v40.78,36.98 | 68.62,13.35 68.67,13.35 v68.77,13.45 | R16.1 73.03,23.1 v73.04,23.11
  Top 0.254: U4.143 68.88,36.23 v69.21,36.24 69.73,36.29 C42.1 | U4.144 68.88,36.73 v68.88,36.75 69.13,37 C40.1 | U4.121 v68.88,25.23 v68.88,25.24 69.88,25.24 C41.1 | U4.131 68.88,30.23 v69.06,30.19 | U4.108 66.08,17.36 v66.08,16.45 66.24,16.3 C33.1 | U4.95 59.58,17.36 v59.58,16.45 C37.1 | U4.84 v54.09,16.45 54.12,16.43 C36.1 | U4.72 v45.71,19.23 v45.71,19.22 | U4.62 45.81,24.23 | 45.81,24.23 v45.81,24.25 | U4.52 45.48,29.23 45.31,29.41 44.94,29.41 C43.1 | U4.39 45.81,35.73 v45.61,35.73 | U4.30 v51.61,35.83 | 45.81,24.23 45.3,24.23 C44.1 | C39.1 v69.06,30.19 | 68.9,30.19 v69.06,30.19 | C34.1 58.16,39.56 58.11,39.52 U4.17 58.11,38.6 58.11,37.74 v57.78,37.41 | v62.25,14.16 62.97,14.16 R19.1 | U4.6 63.6,37.41 v64.05,37.1 | v50.26,37.36 50.1,37.9 U4.33 50.08,38.62 50.08,39.56 50.11,39.59 50.56,39.59 50.6,39.56 U4.32 | R5.2 42.13,31.41 v42.08,31.36
  Top 0.305: R7.1 49.6,41.41 v49.6,40.58 | R6.2 84.88,22.78 v84.9,22.8
  Top 0.406: U10.8 33.01,34.28 v31.59,34.28 | U10.7 v31.59,35.6 | C55.A 41.43,6.21 L12.2 40.24,6.21 v40.25,6.2 | R14.1 v82.24,29.28
  Top 1.219: v13.91,43.12 13.91,41.64 SW2.1
  Top 1.27: 67.87,11.91 C62.A 68,12.73 68.62,13.35 70.15,13.35 70.68,12.82 70.68,11.92 U6.3
  Route2 0.305: 45.69,19.26 v45.71,19.23
  Route2 1.219: U1.1 14.6,42.44 v13.91,43.12
  other vias: 69.79,13.43
  pour Route2 (isolate 0.381): 66.72,10.71 67.53,11.52 70.71,11.52 71.26,12.08 72.51,14.24 78.12,19.86 85.87,19.88 86.02,44.16 85.67,44.54 17.06,44.54 17.31,44.29 17.44,41.67 17.92,41.42 40.43,41.42 41.34,37.36 41.34,14.85 39.21,12.72 37.84,11.22 37.71,4.59 66.51,4.51 66.72,9.19
  pour Route2 (isolate 0.381): 30.88,36.77 30.78,36.54 30.62,35.65 30.62,33.9 31.46,33.06 42.11,33.06 42.23,37.23 31.69,37.23 31.16,37.05
20MHZ_REF
  Top 0.203: U4.23 55.1,39.45 55.75,40.12 57.12,40.12 57.65,40.68 57.65,42.69 58.16,43.17 59.44,43.17 X2.1 59.89,43.48
  Top 0.254: C45.2 61.52,43.06 61.1,43.48 59.76,43.48 X2.1
!RESET  (via drill 0.25)
  Top 0.203: v53.33,41.52 53.33,40.58 54.09,39.84 U4.25
  Top 0.254: R7.2 C32.1
  Top 0.305: C32.1 51.29,43.17 52.95,43.17 53.33,42.79 v53.33,41.52
  Route3 0.203: v79.47,41.01 79.47,42.36 79.29,42.54 53.33,42.51 v53.33,41.52
  Bottom 0.203: J7.5 v79.47,41.01
+5V  (via drill 0.25, 0.89)
  Top 0.406: Q1.3 86.25,35.91 83.91,35.91 R9.2 | 86.83,13.2 87.42,13.2 | 87.42,13.2 88.28,13.23 87.93,13.2 | 87.42,13.2 87.55,13.2 v87.95,13.23
  Top 0.61: 28.13,16.82 U2.6 28.18,18.09
  Top 0.813: 34.69,19.22 34.71,19.45 33.27,20.9 32.7,20.9 | 32.7,20.9 28.92,20.9 | 28.92,20.9 28.69,20.9 28.42,20.62 28.19,19.57 28.18,18.09 | C2.2 29,20.82 28.92,20.9 | 32.7,20.9 C4.2
  Top 1.016: 85.62,36.55 86.25,35.91
  Top 1.219: 80.66,5.23 80.66,8.54 D2.C 80.26,8.94 80.26,11.02 | C60.A 80.15,11.12 80.26,11.02 | 87.93,13.2 85.31,13.18 | 85.31,13.18 D1.4 | 80.26,11.02 80.33,11.02 80.79,11.47 84.78,11.47 85.18,11.88 85.18,13.05 85.31,13.18
  Top 1.27: U6.1 75.82,12.44 77.18,12.44 77.93,11.69 C60.A | 80.66,5.25 80.66,5.23 v80.66,5.17 | v34.69,17.54 34.69,19.22
  Top 1.422: v85.62,37.1 85.62,36.55
  Route3 0.203: 62.32,2.91 62.35,2.89
  Route3 1.27: v80.66,5.17 79.62,2.89 62.35,2.89 35.25,2.89 34.69,3.45 v34.69,17.54
  Bottom 1.016: 85.62,37 85.64,37.05 v85.62,37.1
  Bottom 1.676: v87.95,13.23 87.95,34.61 85.62,37
AUDIO_EN
  Top 0.203: U4.98 61.1,5.23 60.04,4.11 24.17,4.11 23.23,5.05 23.23,6.58 | 23.23,6.58 23.23,9.04 24.63,10.18 25.26,10.43 25.49,10.66 25.49,11.46 U2.1 | 23.23,6.58 R3.1
AUDIO_LEFT
  Top 0.61: C56.1 4.14,28.69 J1.L | C56.1 6.51,27.31 7.13,26.43 11.73,26.43 12.13,26.28 12.13,21.98 J1.R | C56.1 6.51,29.68 R1.1
  pour Top (isolate 0.381): 0.6,29.99 0.6,32.58 2.1,34.08 5.2,34.08 5.38,33.9 5.38,26.46 5.1,26.18 0.83,26.18 0.55,26.46 0.55,29.94
  pour Top (isolate 0.381): 16.27,18.59 8.75,18.51 8.3,18.76 8.3,22.24 9.31,22.47 16.48,22.47 16.71,22.24 16.71,18.64
AUDIO_RIGHT
  Top 0.305: R17.1 30.36,8.68 C57.1 29.38,11.53 U2.4 29.42,13.44 28.95,13.91 23.82,13.91 22.37,15.36 22.37,20.67 23.21,21.51 23.69,21.51 C3.1
  Top 0.406: R4.1 25.57,21.58 C3.1
BOOT0
  Top 0.203: U4.138 67.99,33.75 69.59,33.75 69.89,34.05 R8.1 69.97,34.11 69.97,34.66 70.17,34.87 72.28,34.87 72.66,35.25 72.66,45.69 71.66,46.69 SW2.2
FLASH_CS  (via drill 0.25)
  Top 0.127: U10.1 39.62,34.33 v39.85,34.56 | v39.97,40.02 48.94,40.02 49.09,39.87 U4.35
  Route3 0.127: v39.85,34.56 39.85,39.9 v39.97,40.02
GND  (via drill 0.25, 0.64)
  Top 0.152: U4.16 | 51.11,38.75 51.09,38.73
  Top 0.203: 51.09,38.73 51.1,38.73 U4.31 | R8.2 v71.67,34.08 | C52.2 v36.41,8 | C30.2 38.45,37.98 U10.4 | v102.47,31.95 102.47,31.93 J3.SH5 | v102.47,34.01 102.47,33.93 J3.SH6
  Top 0.254: U4.38 47.81,36.23 v48.18,35.83 | U4.51 v47.84,29.73 v47.85,29.74 | U4.61 47.39,24.73 v47.82,24.91 | U4.83 53.6,18.4 v53.56,18.43 | U4.94 59.1,18.05 v59.15,18.33 | U4.107 65.6,18.03 v65.85,18.48 | U4.120 v66.82,24.73 | U4.130 67.5,29.73 v66.92,29.74 | 51.11,38.88 51.09,38.85 51.09,38.73 51.09,37.71 v51,37.41 | U5.8 v36.74,10.01 | v49.6,37.53 49.6,37.95 U4.34 | U4.16 58.59,37.76 v58.79,37.56 | 51.11,41.44 51.25,41.57 C32.2 | 85.17,29.88 v85.18,29.86
  Top 0.305: 51.11,41.44 51.25,41.3 v51.25,40.48 | C40.2 v71.39,37 | J3.SH6 J3.SH7 | J3.SH7 102.45,36.28 102.46,36.29 | 102.46,36.29 J3.SH8 | 102.46,36.29 J3.SH7 | 102.46,35.68 J3.SH7 | J3.SH7 | J3.5 J3.SH2 | J3.SH5 J3.SH4 J3.SH3 | J2.GND@1 99.13,9.26 99.13,10.37 J2.B12
  Top 0.406: C35.2 v43.53,35.73 | C43.2 v43.32,29.3 | C44.2 v43.35,24.3 | C38.2 45.51,16.78 v45.53,16.76 | C36.2 v54.12,13.86 | v59.61,13.89 59.61,14.33 C37.2 | C33.2 v66.26,14.27 | C41.2 v71.47,25.27 | C39.2 v71.09,30.19 | C42.2 71.39,36.19 v71.42,36.21 | C34.2 v60.01,39.95 | X2.GND@2 56.3,43.48 | v60.85,41.27 59.77,41.27 X2.GND@1 | 70.85,5.71 v70.82,5.69 | 78.01,8.43 78.01,8.53 C60.C | 67.85,8.38 C62.C 67.85,8.61 | 72.98,13.49 73.03,13.54 73.03,13.49 | C46.C 40.48,19.32 | 40.48,19.32 v40.07,19.88 | 40.43,19.32 40.35,19.27 v40.05,19.3 | 40.48,19.32 40.43,19.32 | 40.43,19.32 40.05,18.69 | 64.86,11.85 C48.C 64.86,11.8 65.4,11.27 | 64.86,11.85 v64.31,11.3 | 64.86,11.85 v64.86,11.27 64.89,11.24 | C45.1 62.51,41.31 v62.53,41.29 | C47.1 54.32,43.96 v54.35,43.98 | C55.C 45.04,6.05 | 45.04,6.05 45.2,6.05 v45.37,5.72 | 45.04,6.05 v45.35,6.35 | C49.2 44.44,11.89 v44.46,11.92 | R18.1 94.66,12.38 v94.21,12.39 | C30.2 40.6,37.98 v40.76,38.14 | C1.2 26.52,7.37 v26.48,6.53 | U2.7 26.84,16.85 v26.84,18.45 | Q16.2 85.17,29.88 | R3.2 21.34,6.8 v20.25,6.8
  Top 0.61: C50.2 45,12.91 45,12.78 v46.11,12.78 | R15.2 31.59,7.05 v31.41,7.07 | 70.85,5.71 U6.4 75.09,5.71 v75.16,5.64 | 78.01,8.53 v77.27,7.14 | 78.01,8.43 78.26,7.19 | 67.85,8.38 v68.43,8.02 | 67.85,8.61 v67.47,8 | U6.2 72.98,13.49 | 73.03,13.49 v72.95,13.41 | X2.GND@2 56.05,44.34 v56,44.39 | R2.2 8.31,28.74 | 8.31,28.74 C56.2 | 8.31,28.74 8.33,28.69 v8.27,27.64 | D1.1 85.85,15.59 v86.11,15.85
  Top 0.813: C57.2 v29.43,5.9 | C51.1 41.44,12.58 v41.49,12.63 | v2.35,18.67 2.35,20.15 J1.G 1.21,19.96 1.21,18.64 | C2.1 30.65,17.68 v30.7,17.63 | C4.1 32.63,17.67 v32.58,17.62 | C1.2 26.48,7.77 26.46,6.57
  Route3 0.254: v97.03,17.94 103.97,17.94 103.98,17.95 | v102.49,19.19 102.49,16.89 102.48,16.88
  Bottom 0.406: R21.1 102.15,15.05 102.15,16.56
  Bottom 0.61: 99.08,9.26 J2.GND@1 | 96.87,18 96.93,17.94 v97.03,17.94 J2.GND@3 102.29,17.94 102.3,17.95 | 97.63,19.3 v102.49,19.19 J2.GND@4 102.5,17.94 102.53,17.9 102.53,16.53 102.51,16.5 | 102.43,10.74 102.49,10.68 J2.GND@2 102.54,6.7 102.51,6.55 | J2.A1 97.66,9.18 99.13,9.24 99.4,9.51 J2.B12
  other vias: 78.26,7.14 40.05,18.71 65.4,11.24 61.08,40.17 54.83,37.18 1.21,18.72 102.46,34.94 102.46,30.85
  pour Bottom (isolate 0.254, rank 2): -0.01,52.01 104.79,52.06 104.72,-0.08 -0.01,-0.01
I2S2_F_CK
  Top 0.127: U4.74 49.1,10.41 47.92,9.24 44.98,9.24 44.9,9.31 44.9,9.29 R11.2
I2S2_F_MCLK  (via drill 0.25)
  Top 0.127: R13.2 47.78,11.1 v47.82,11.14 | v60.29,11.14 60.29,11.45 60.09,11.65 60.09,17.35
  Top 0.203: U4.96 60.09,17.35
  Route2 0.127: v47.82,11.14 v60.29,11.14
I2S2_F_WS
  Top 0.127: U4.73 48.6,10.57 48.2,10.18 44.98,10.18 R12.2
I2SD_F_SDO
  Top 0.127: U4.76 50.1,10.39 48,8.3 44.98,8.3 R10.2
LCD_CS  (via drill 0.25)
  Top 0.127: U4.40 45.82,35.23 45.69,35.09 42.11,35.09 41.88,35.32 41.88,38.78 41.7,38.96 23.67,38.96 v23.28,38.58
  Route2 0.254: v23.28,38.58 20.77,38.58 U1.3
LCD_DC  (via drill 0.25)
  Top 0.127: U4.59 25.05,25.73 24.71,26.08 24.71,31.84 v24.48,32.07
  Route2 0.254: v24.48,32.07 19.75,32.07 U1.5
LCD_LED
  Top 0.127: U4.60 20.13,25.23 U1.8
LCD_RESET  (via drill 0.25)
  Top 0.127: U4.58 25.57,26.23 25.44,26.36 25.44,34.89 v25.37,34.97
  Route2 0.254: v25.37,34.97 19.7,34.97 U1.4
MCU_USART1_RX  (via drill 0.25)
  Top 0.203: v74.29,33.57 73.95,33.23 U4.137
  Bottom 0.203: J5.4 68.9,42.94 68.9,41.37 69.23,41.04 73.68,41.04 74.29,40.43 v74.29,33.57 74.29,33.49
MCU_USART1_TX  (via drill 0.25)
  Top 0.203: v74.97,33.04 74.67,32.73 U4.136
  Bottom 0.203: J5.3 69.94,42.96 69.94,41.83 70.17,41.6 74.34,41.6 74.97,40.96 v74.97,33.04
MCU_USART6_RX  (via drill 0.25)
  Top 0.203: v73.47,27.12 73.09,26.74 68.09,26.74 68.06,26.71 67.86,26.71 67.88,26.73 U4.124
  Bottom 0.203: J5.5 67.94,42.97 67.94,40.91 68.27,40.58 72.97,40.58 73.47,40.07 v73.47,27.12
MCU_USART6_TX  (via drill 0.25)
  Top 0.203: v72.81,29.66 72.39,29.23 U4.129
  Bottom 0.203: J5.6 66.95,42.96 66.95,40.56 67.43,40.07 72.28,40.07 72.81,39.54 v72.81,29.66
N$1  (via drill 0.25)
  Top 0.203: R22.1 79.65,19.17 v80.08,18.74
  Top 0.254: 87.76,8.59 87.76,9.78 v87.55,10
  Top 1.219: R20.1 87.76,8.59 85.01,8.59 D2.A
  Route3 0.254: v87.55,10 80.54,10 80.13,10.41 80.13,18.69 v80.08,18.74
N$2  (via drill 0.25)
  Top 0.127: U2.8 25.61,16.8 25.6,16.78
  Top 0.305: v25.6,18.79 25.6,16.78 25.67,16.7
  Top 0.406: v25.6,18.79
  Top 0.813: v7.05,4.08 7.05,6.82 7.08,6.85 7.08,7.1 7.33,7.36
  Route2 0.813: v25.6,18.79 23.36,16.55 23.36,4.16 21.61,2.41 8.73,2.41 v7.05,4.08
  pour Top: 14.9,13.33 14.9,7.08 13.56,5.73 5.1,5.73 4.36,6.47 4.36,12.9 4.87,13.3
N$3
  Top 0.203: Q16.1
  Top 0.254: U4.119 83.24,24.23 83.86,24.86 83.86,30.42 83.81,30.47 83.81,30.5 Q16.1
  Top 0.406: R14.2 83.88,29.28 Q16.1
N$5
  Top 0.406: U2.2 26.79,11.48 C1.1 27.7,9.41 28.16,9.87 28.16,11.57 U2.3
N$6  (via drill 0.25, 0.64)
  Top 0.305: v29.4,15.39 29.43,16.62 U2.5 | R4.2 v26.61,19.9 v26.61,19.91
  Top 0.406: R4.2 23.89,19.91 23.82,19.83 C3.2
  Top 0.813: v1.9,5.89 1.9,7.99 1.92,8.02 1.92,8.03 J4.G
  Route3 0.305: v26.61,19.91 28.75,19.91 29.43,19.22 29.43,15.41 v29.4,15.39
  Route3 0.813: v29.4,15.39 29.51,14.47 29.51,10.94 27.75,9.19 27.75,5.2 27.17,4.62 25.09,4.62 22.78,2.3 5.48,2.3 v1.9,5.89
N$16  (via drill 0.25)
  Top 0.127: U5.7 36.18,10.51 36.06,10.64
  Top 0.203: 36.06,10.64 36.06,20.52 v37.38,21.84 | 14.57,28.82 14.47,28.72 14.47,28.69 14.53,28.69 C53.2
  Top 0.305: 14.57,28.82 14.57,37.97 15.26,38.6 v15.74,38.6
  Route3 0.203: v28.36,29.13 28.36,39.84 27.6,40.61 22.19,40.61 21.66,40.07 21.66,38.91 21.38,38.63 15.76,38.63 v15.74,38.6
  Bottom 0.254: v28.36,29.13 37.31,29.13 37.36,29.07 37.36,21.86 v37.38,21.84
N$20
  Bottom 0.406: J2.B5 R21.2
N$26
  Top 0.254: U5.10 37.49,9.02 35.62,9.02 35.04,8.26 35.04,7.68 34.57,7.05 C54.2
N$27
  Top 0.254: U5.4 42.63,10.51 43.24,11.13 43.94,11.13 R13.1
N$29
  Top 0.203: U5.3 43.79,10.01 R12.1
N$30
  Top 0.254: U4.106 65.12,15.4
  Top 0.406: 65.12,15.4 65.1,15.21 C48.A
N$34
  Top 0.254: U5.2 43.46,9.51 43.7,9.27 43.91,9.27 R11.1
N$35
  Top 0.254: U4.71 45.54,19.73
  Top 0.305: 45.54,19.73 43.84,19.73 C46.A
N$43
  Top 0.254: U5.1 42.59,9.01 43.27,8.34 43.94,8.34 R10.1
N$51
  Top 0.254: U5.6 37.48,11.03 36.87,11.03 36.79,11.1 36.79,11.94 37.38,12.53 37.4,12.53 37.5,12.63 C51.2
N$53
  Top 0.254: U5.5 42.2,11 42.9,11.78 42.9,11.82 42.9,12.4 C50.1
  Top 0.406: C49.1 42.9,11.82
N$56
  Top 0.61: C53.1 R2.1 11.32,28.76 11.32,30.65 10.97,31 R1.2
N$57
  Top 0.406: R17.2 31.54,8.73
  Top 0.61: C54.1 31.54,8.75 31.54,8.74 31.74,8.74 R15.1 31.58,8.75 R17.2
N$63
  cutout Top (no thermals): 88.99,45.94 95.34,45.94 95.34,43.55 88.99,43.55
  cutout Route2 (no thermals): 88.99,45.94 95.34,45.94 95.34,43.55 88.99,43.55
  cutout Route3 (no thermals): 88.99,45.94 95.34,45.94 95.34,43.55 88.99,43.55
  cutout Bottom (no thermals): 88.99,45.94 95.34,45.94 95.34,43.55 88.99,43.55
N$66
  Top 0.203: U5.9 38.46,9.51 38.52,9.45 38.52,8.21 38.32,8 C52.1
  Top 0.254: U5.9
  Top 0.305: C52.1 37.88,7.58 38.09,7.37 L12.1
  Top 0.61: L12.1 39.19,7.47
N$122
  Top 0.406: J2.A5 96.44,12.34 96.41,12.31 R18.2
N$137
  Top 0.406: Q16.3 83.89,33.12 R9.1 82.73,34.19 82.34,34.59 82.34,40.05 82.62,40.33 86.18,40.33 Q1.1
N$173
  cutout Top (no thermals): 88.99,45.94 95.34,45.94 95.34,43.55 88.99,43.55
  cutout Route2 (no thermals): 88.99,45.94 95.34,45.94 95.34,43.55 88.99,43.55
  cutout Route3 (no thermals): 88.99,45.94 95.34,45.94 95.34,43.55 88.99,43.55
  cutout Bottom (no thermals): 88.99,45.94 95.34,45.94 95.34,43.55 88.99,43.55
SD_CS  (via drill 0.25)
  Top 0.203: U4.126 v83.07,27.73
  Route2 0.203: v83.07,27.73 89.7,27.73 91.74,29.76 92.52,29.76 U1.18
SPI1_MISO  (via drill 0.25)
  Top 0.127: v36.19,34.18 36.19,35.17 36.62,35.6 U10.2 40.71,35.6 40.86,35.45 40.86,34.77 41.39,34.23 42.03,34.23 | v35.27,22.55 19.91,22.55 19.63,22.27 19.63,22.19 U1.9 | U4.42 42.03,34.23 | 42.03,34.23 42.05,34.21 42.05,33.96
  Top 0.813: 42.05,33.96 R5.1
  Route2 0.127: v35.27,22.55 35.27,31.59 36.19,32.5 v36.19,34.18
SPI1_MOSI  (via drill 0.25)
  Top 0.127: v23.44,30.04 23.44,37.84 23.61,38.12 32.71,38.12 32.94,38.24 32.94,38.14 32.96,38.12 33.04,38.12 U10.5 v34.59,38.14 | U4.43 45.11,33.73 v45.08,33.7
  Route2 0.254: U1.6 23.13,29.74 v23.44,30.04
  Route3 0.127: v34.59,38.14 34.89,37.84 34.89,33.6 35.15,33.34 36.57,33.34 36.92,33.7 v45.08,33.7
SPI1_SCK  (via drill 0.25)
  Top 0.127: v26.33,27.48 26.33,36.59 26.59,36.85 33.04,36.85 U10.6 35.17,36.87 35.81,36.24 41.12,36.24 41.44,35.91 41.44,35.04 41.76,34.73 U4.41
  Route2 0.254: U1.7 26.05,27.2 v26.33,27.48
SPI3_MISO  (via drill 0.25)
  Top 0.203: U4.112 69.68,20.73 70.4,21.45 71.71,21.45 R16.2 83.36,22.1 83.74,22.47 83.74,23.11 v84.12,23.49
  Route3 0.203: v84.12,23.49 91.15,23.49 92.45,24.78 92.45,24.73 92.63,24.55 92.63,24.58 U1.16
SPI3_MOSI  (via drill 0.25)
  Top 0.203: U4.113 69.39,21.23 69.99,21.84 69.99,23.36 70.4,23.77 83.56,23.77 84.6,24.81 86.33,24.81 v86.35,24.83
  Route2 0.203: v86.35,24.83 88.87,24.83 91.2,27.17 92.52,27.17 U1.17
SPI3_SCLK  (via drill 0.25)
  Top 0.203: U4.111 86.02,20.23 v86.23,20.03
  Route3 0.203: v86.23,20.03 90.34,20.03 92.52,22.22 92.52,22.14 U1.15
SWCLK  (via drill 0.25)
  Top 0.127: v65.17,28.74 65.17,19.98 65.32,19.83 66.34,19.83 67,19.17 67.91,19.17 U4.109
  Top 0.203: 67.96,19.22 U4.109
  Route3 0.203: v82.21,30.4 72.46,30.4 71.14,29.07 65.5,29.07 v65.17,28.74
  Bottom 0.203: J7.2 82.47,30.65 v82.21,30.4
SWDIO  (via drill 0.25)
  Top 0.127: v64.63,30.62 64.63,20.49 v64.31,20.16
  Top 0.203: v64.63,18.51 64.63,18.33 64.58,18.28 64.58,17.37 U4.105
  Route3 0.127: v64.31,20.16 64.31,18.84 v64.63,18.51
  Route3 0.203: v80.33,31.01 65.02,31.01 v64.63,30.62
  Bottom 0.203: J7.4 80.47,31.14 v80.33,31.01
SWO/I2S3_F_CK  (via drill 0.25)
  Top 0.203: v78.5,31.84 77.89,31.23 U4.133
  Bottom 0.203: J7.6 78.5,42.96 v78.5,31.84
TOUCH_CS  (via drill 0.25)
  Top 0.127: U4.37 43.29,36.73 42.89,37.13 42.89,38.65 42.21,39.34 23.11,39.34 22.65,38.88 22.65,26.61 v22.55,26.51
  Route2 0.254: v22.55,26.51 21.68,26.51 21.1,25.93 21.1,18.79 19.83,17.52 19.83,17.32 U1.11
TOUCH_DIN  (via drill 0.25)
  Top 0.127: U4.65 36.8,22.73 35.83,21.76 26.87,21.76 v26.79,21.68 | 19.6,14.45 U1.12
  Top 0.254: v21.15,17.77 21.15,14.72 20.87,14.45 19.6,14.45
  Route3 0.127: v26.79,21.68 23.94,21.68 23.72,21.45 23.72,18.89 22.88,18.05 21.43,18.05 v21.15,17.77
TOUCH_DOUT  (via drill 0.25)
  Top 0.127: U4.64 21.84,23.23 v21.71,23.11 | 19.45,11.91 19.5,11.91 U1.13
  Top 0.254: v21.73,18.74 21.73,12.16 21.48,11.91 19.5,11.91
  Route2 0.127: v21.71,23.11 21.71,18.76 v21.73,18.74
TOUCH_IRQ  (via drill 0.25)
  Top 0.203: U4.66 39.12,22.23 v38.47,21.23 | 19.47,9.47 19.45,9.44 19.52,9.44 U1.14
  Top 0.254: v24.53,11.07 24.02,11.07 22.42,9.47 19.47,9.47
  Route2 0.203: v38.47,21.23 38.47,14.85 37.48,14.22 25.39,14.22 24.63,13.45 24.63,11.17 v24.53,11.07
TOUCH_SCK  (via drill 0.25)
  Top 0.127: U4.63 22.82,23.73 v22.8,23.72
  Route3 0.127: v22.8,23.72 22.8,19.83 22.5,19.52 19.6,19.52 U1.10 19.47,19.65
USB_MCU_N
  Top 0.127: R34.1 79.06,14.39 75,14.39 74.42,14.98 67.56,14.98 67.15,15.39 67.15,18.41 66.21,19.35 64,19.35 63.6,18.94 U4.103
USB_MCU_P
  Top 0.127: R35.1 79.19,14.14 74.89,14.14 74.31,14.72 67.45,14.72 66.9,15.28 66.9,18.3 66.11,19.09 64.46,19.09 64.1,18.8 U4.104 64.1,16.52 63.29,15.71 63.29,15.65 R19.2
USB_N  (via drill 0.25)
  Top 0.127: R34.2 80.64,14.87 81.09,14.5 82.54,14.5 83.38,15.33 | J3.2 98.79,32.26 98.6,32.45 90.82,32.45 89.96,31.59 89.96,14.85 89.38,14.27 84.55,14.27 v84.32,14.04 | v83.38,14.65 83.38,15.33 | 83.38,15.33 83.38,15.41 D1.2
  Route2 0.127: v84.32,14.04 83.84,14.19 v83.38,14.65
USB_OTG_FS_ID  (via drill 0.25)
  Top 0.127: U4.102 63.1,20.52 v63.77,21.2
  Top 0.254: 86.73,20.85 84.92,20.85 R6.1
  Top 0.305: J3.4 88.04,33.56 87.19,32.71 87.19,21.3 86.73,20.85 v71.16,20.82
  Route3 0.127: v63.77,21.2 70.78,21.2 v71.16,20.82
USB_P
  Top 0.127: R35.2 80.64,13.72 81.12,14.06 82.9,14.06 83.3,13.66 | J3.3 98.8,32.91 98.6,32.71 90.72,32.71 89.7,31.69 89.7,14.95 89.27,14.52 83.96,14.52 83.46,14.01 83.46,13.53 83.3,13.38 | 83.3,13.78 83.3,13.66 | 83.3,13.66 83.3,13.38 | 83.3,13.38 D1.3
USB_TYPEC_DET
  Top 0.203: U4.110 73.1,19.73 R22.2
VBUS  (via drill 0.64)
  Top 1.219: v94.43,11.04 94.43,8.81 94.5,8.73 94.5,8.67 R20.2
  Route3 0.61: J2.A9 J2.B4 97.09,15.74 96.56,15.21 96.56,11.91 96.94,11.52 | J2.B9 J2.A4 96.97,11.5 96.94,11.52 | 96.94,11.52 96.41,11.6 95.85,11.04
  Route3 1.219: v94.43,11.04 95.85,11.04 96.64,11.04 96.82,11.22
VBUS_5V  (via drill 0.25, 0.89)
  Top 0.203: U4.101 62.6,25.82 v62.86,26.08 | 94.33,31.72 v94.61,31.44
  Top 0.406: J3.1 97.88,31.61 97.71,31.44
  Top 1.016: v97.07,38.47 93.65,38.47 Q1.4 | v94.61,31.44 94.63,31.44
  Top 1.27: 97.71,31.44 v94.61,31.44
  Route3 0.203: v62.86,26.08 87.82,26.08 88.46,26.71 88.46,30.93 88.92,31.72 94.33,31.72 v94.61,31.44
  Bottom 1.016: v94.61,31.44 94.61,36.01 v97.07,38.47
X2
  Top 0.203: U4.24 54.6,39.83 X2.3
  Top 0.254: C47.2 55.98,41.36 X2.3

### Text on the board
Top: 1 | 1
Route2: 2 | 2
Route3: 3 | 3
Bottom: 4 | 4
tPlace: DFU PGM | REV3 | TO P25RX | plated slot | AUDIO | LINE-OUT | plated slot | DATA / + / SW POWER OUT | TYPE-C | HPHONE | (MONO) | POWER IN | SPEAKER-OUT
bPlace: UART | STLINK